# Altium project ZYNQ-HS-DEV.PrjPcb (part 2 of 4)

## Sheet ZHSD-USB-OTG.SchDoc
size A3; DocumentNumber: 10; SheetNumber: 10; SheetTotal: 17; Size: A3
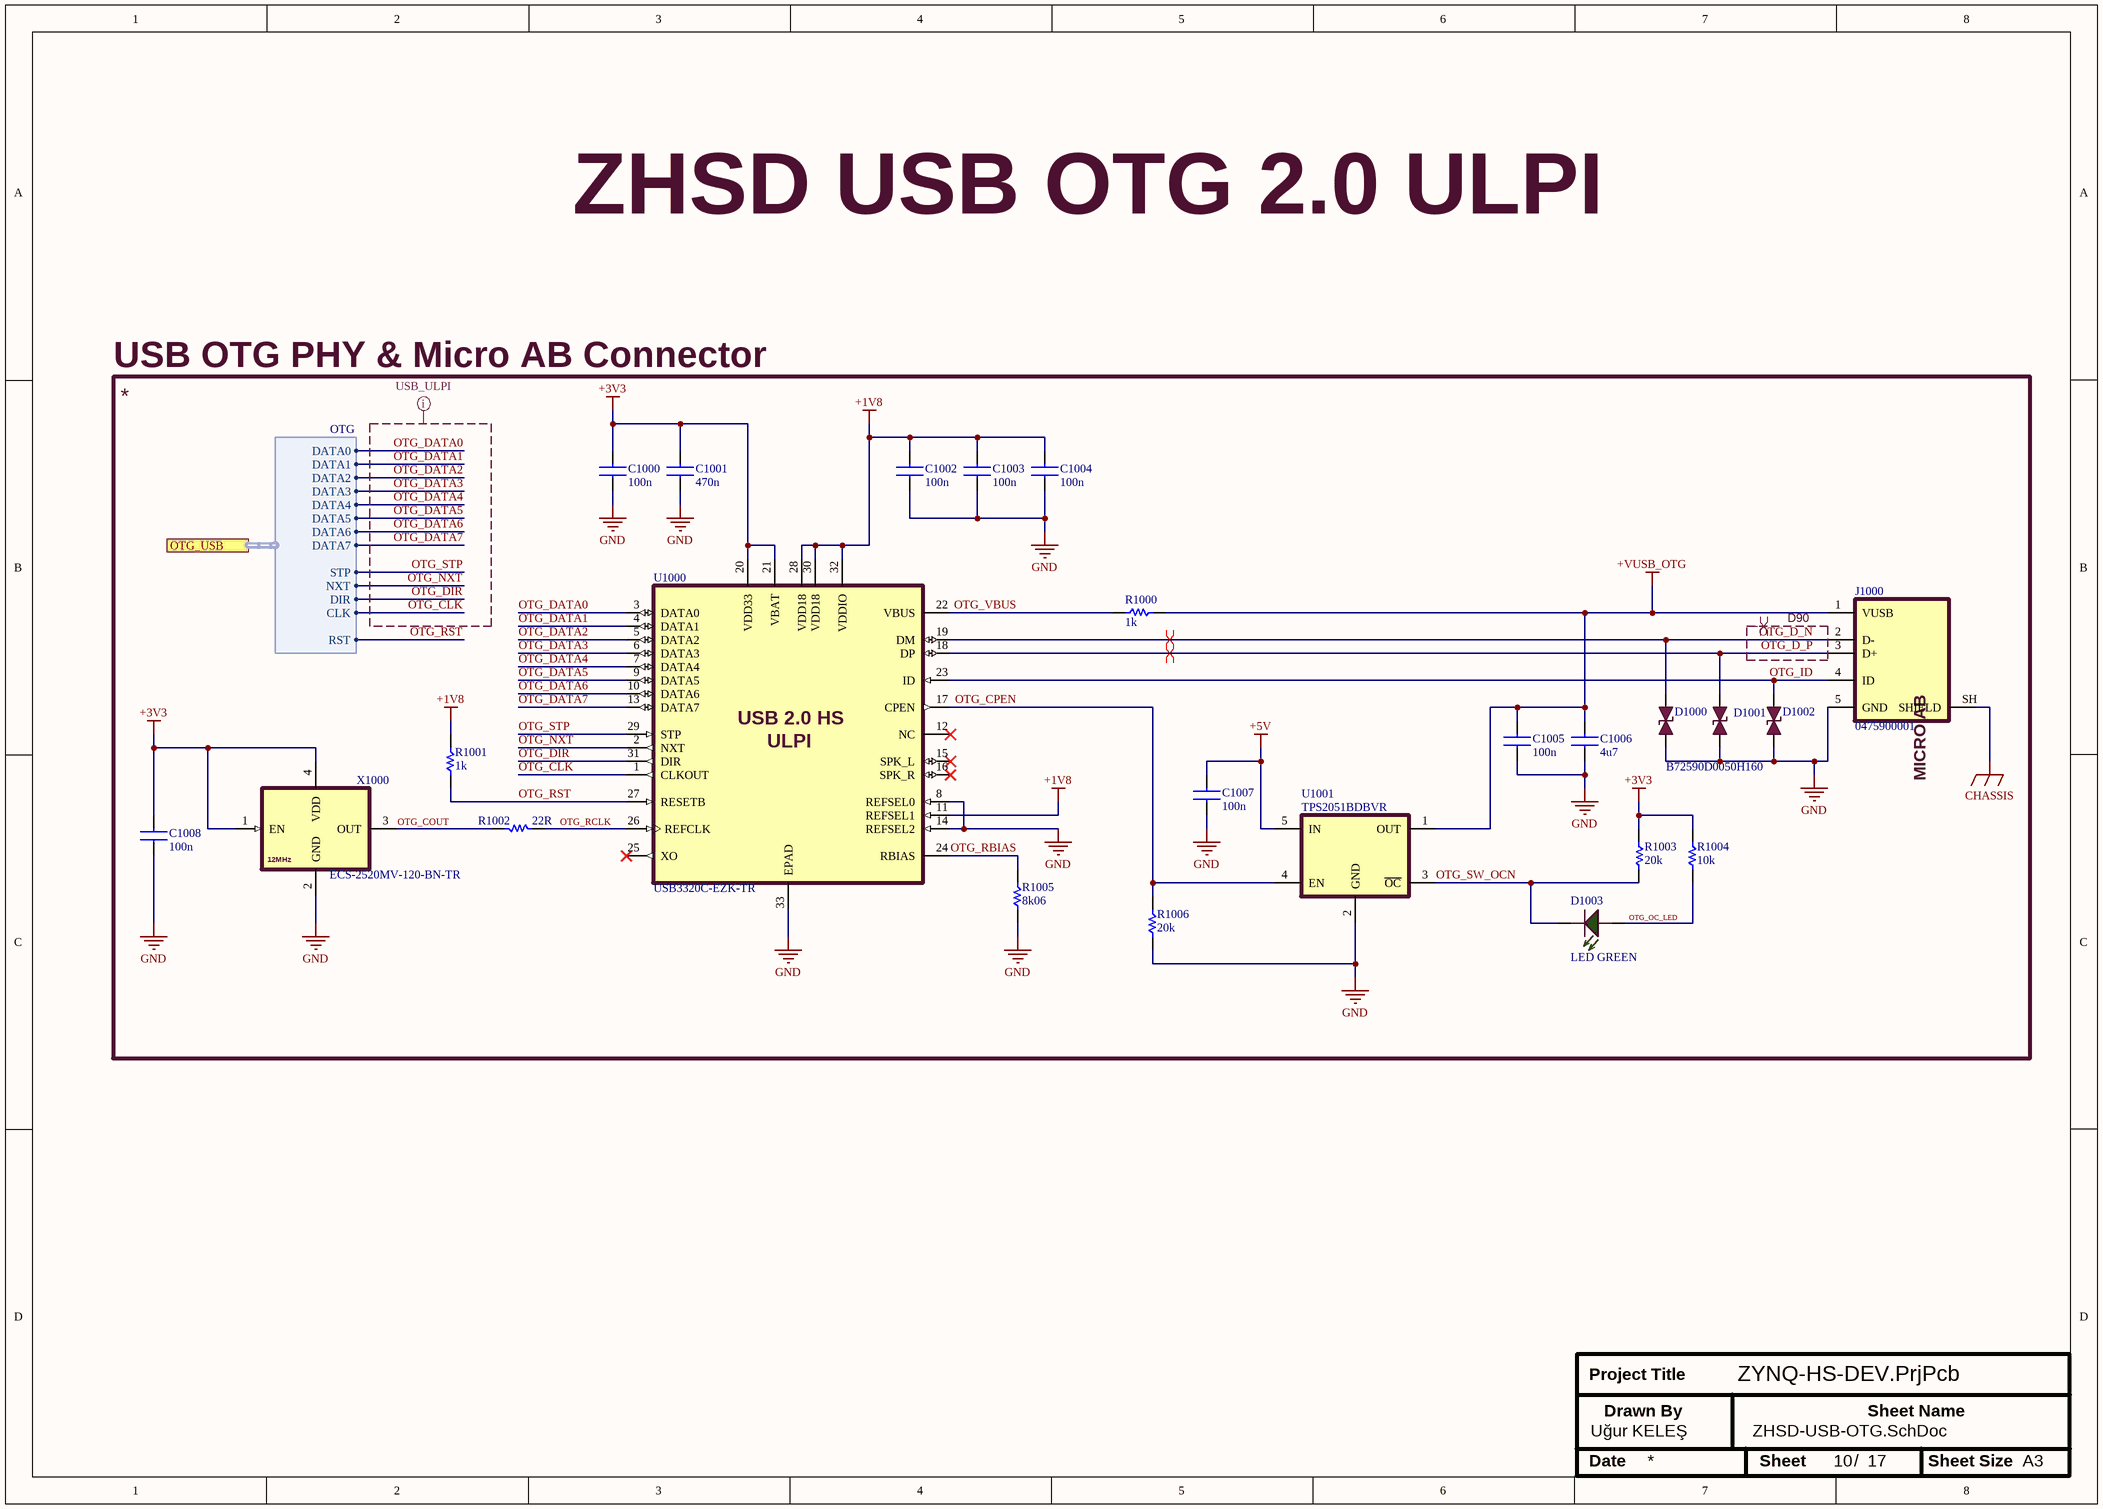
[diagram p6: ZHSD-USB-OTG.SchDoc]

### Parts
C1000  100n  [0603CAPC1608X09N]
C1001  470n  [0402CAPC1005X06N]
C1002  100n  [0603CAPC1608X09N]
C1003  100n  [0603CAPC1608X09N]
C1004  100n  [0603CAPC1608X09N]
C1005  100n  [0603CAPC1608X09N]
C1006  4u7  [0603CAPC1608X09N]
C1007  100n  [0603CAPC1608X09N]
C1008  100n  [0603CAPC1608X09N]
D1000  B72590D0050H160  [0402DIOC1005X06N]  (value not drawn)
D1001  B72590D0050H160  [0402DIOC1005X06N]  (value not drawn)
D1002  B72590D0050H160  [0402DIOC1005X06N]
D1003  LED GREEN  [0603_LED_1608N]
J1000  0475900001  [USB2.0 MICRO AB SMD]
R1000  1k  [0603RESC1608X05N]
R1001  1k  [0603RESC1608X05N]
R1002  22R  [0603RESC1608X05N]
R1003  20k  [0402RESC1005X04N]
R1004  10k  [0603RESC1608X05N]
R1005  8k06  [0402RESC1005X04N]
R1006  20k  [0402RESC1005X04N]
U1000  USB3320C-EZK-TR  [QFN50P500X500X100_HS-33N]
U1001  TPS2051BDBVR  [SOT95P280X125-5N]
X1000  ECS-2520MV-120-BN-TR  [XTAL_2520]

### Ports
OTG_USB (harness OTG, see ZHSD-Block[4000,3700], ZHSD-ZYNQ-MIO[8100,8300])

### Harnesses
OTG: DATA0, DATA1, DATA2, DATA3, DATA4, DATA5, DATA6, DATA7, STP, NXT, DIR, CLK, RST

### Nets
+1V8: C1002.2 C1003.2 C1004.2 R1001.2 U1000.11(REFSEL1) U1000.28(VDD18) U1000.30(VDD18) U1000.32(VDDIO)
+3V3: C1000.2 C1001.2 C1008.2 R1003.1 R1004.2 U1000.20(VDD33) U1000.21(VBAT) X1000.1(EN) X1000.4(VDD)
+5V: C1007.2 U1001.5(IN)
+VUSB_OTG: C1005.2 C1006.2 J1000.1(VUSB) R1000.2 U1001.1(OUT)
CHASSIS: J1000.SH(SHIELD)
GND: C1000.1 C1001.1 C1002.1 C1003.1 C1004.1 C1005.1 C1006.1 C1007.1 C1008.1 D1000.1 D1001.1 D1002.1 J1000.5(GND) R1005.1 R1006.1 U1000.8(REFSEL0) U1000.14(REFSEL2) U1000.33(EPAD) U1001.2(GND) X1000.2(GND)
OTG_CLK: U1000.1(CLKOUT) ; port OTG_USB.CLK
OTG_COUT: R1002.2 X1000.3(OUT)
OTG_CPEN: R1006.2 U1000.17(CPEN) U1001.4(EN)
OTG_D_N: D1000.2 J1000.2(D-) U1000.19(DM)
OTG_D_P: D1001.2 J1000.3(D+) U1000.18(DP)
OTG_DATA0: U1000.3(DATA0) ; port OTG_USB.DATA0
OTG_DATA1: U1000.4(DATA1) ; port OTG_USB.DATA1
OTG_DATA2: U1000.5(DATA2) ; port OTG_USB.DATA2
OTG_DATA3: U1000.6(DATA3) ; port OTG_USB.DATA3
OTG_DATA4: U1000.7(DATA4) ; port OTG_USB.DATA4
OTG_DATA5: U1000.9(DATA5) ; port OTG_USB.DATA5
OTG_DATA6: U1000.10(DATA6) ; port OTG_USB.DATA6
OTG_DATA7: U1000.13(DATA7) ; port OTG_USB.DATA7
OTG_DIR: U1000.31(DIR) ; port OTG_USB.DIR
OTG_ID: D1002.2 J1000.4(ID) U1000.23(ID)
OTG_NXT: U1000.2(NXT) ; port OTG_USB.NXT
OTG_OC_LED: D1003.1(A) R1004.1
OTG_RBIAS: R1005.2 U1000.24(RBIAS)
OTG_RCLK: R1002.1 U1000.26(REFCLK)
OTG_RST: R1001.1 U1000.27(RESETB) ; port OTG_USB.RST
OTG_STP: U1000.29(STP) ; port OTG_USB.STP
OTG_SW_OCN: D1003.2(C) R1003.2 U1001.3(~{OC})
OTG_VBUS: R1000.1 U1000.22(VBUS)

Not connected (* = marked no-connect by the designer): U1000 12(NC)* 15(SPK_L)* 16(SPK_R)* 25(XO)*

### Layout directives
differential pair: OTG_D_N, OTG_D_P
differential pair; differential pair class USB; rule Differential Pairs Routing [Pref Gap = 6.299mil    Min Gap  = 5mil    Max Gap  = 7.874milPref Width = 3.937mil    Min Width  = 3.937mil    Max Width  = 4.768mil]; Impedance: D90: OTG_D_N, OTG_D_P
net class USB_ULPI; rule Matched Net Lengths [Delay Tolerance = 10ps]: OTG_CLK, OTG_DATA0, OTG_DATA1, OTG_DATA2, OTG_DATA3, OTG_DATA4, OTG_DATA5, OTG_DATA6, OTG_DATA7, OTG_DIR, OTG_NXT, OTG_STP

### Notes on the sheet
- ZHSD USB OTG 2.0 ULPI
- USB OTG PHY & Micro AB Connector
- *
- Project Title
- Uğur KELEŞ
- Drawn By
- Sheet Name
- Date
- Sheet
- /
- Sheet Size
- A3
- (in symbol ECS-2520MV-120-BN-TR) 12MHz
- (in symbol USB3320C-EZK-TR) USB 2.0 HS; ULPI
- (in symbol USB-MICRO-AB) MICRO AB

### Library data of the parts
C1000 C1002-C1005 C1007 = GRM155R71C104KA88J: CAP CER 0.1UF 16V X7R 0402 (1005) ±10%; Manufacturer: Murata Electronics; Value: 0.1 µF; ComponentLink1Description: Datasheet; ComponentLink1URL: https://search.murata.co.jp/Ceramy/image/img/A01X/G101/ENG/GRM155R71C104KA88-01.pdf; MPN: GRM155R71C104KA88J; Package: 0402; Tolerance: ±10%; Voltage: 16V
C1001 = GRM155R60J474KE19D: CAP CER 0.47UF 6.3V X5R 0402(1005) ±10%; Manufacturer: Murata Electronics; Value: 0.47 µF; ComponentLink1Description: Datasheet; ComponentLink1URL: https://search.murata.co.jp/Ceramy/image/img/A01X/G101/ENG/GRM21BR71A475KE51-01.pdf; MPN: GRM155R60J474KE19D; Package: 0402; Tolerance: ±10%; Voltage: 6.3V
C1006 = CL10A475KP8NNNC: CAP CER 4.7UF 10V X5R 0603 (1608) ±10%; Manufacturer: Samsung Electro-Mechanics; Value: 4.7 µF; ComponentLink1Description: Datasheet; ComponentLink1URL: https://mm.digikey.com/Volume0/opasdata/d220001/medias/docus/609/CL10A475KP8NNNC_Spec.pdf; MPN: CL10A475KP8NNNC; Package: 0603; Tolerance: ±10%; Voltage: 10V
C1008 = C0603C104K5RACTU: CAP CER 0.1UF 50V X7R 0603 (1608) ±10%; Manufacturer: KEMET; Value: 0.1 µF; ComponentLink1Description: Datasheet; ComponentLink1URL: https://yageogroup.com/content/datasheet/asset/file/KEM_C1002_X7R_SMD; MPN: C0603C104K5RACTU; Package: 0603; Tolerance: ±10%; Voltage: 50V
D1000-D1002 = B72590D0050H160: Varistor 1 Circuit Surface Mount, MLCV 0402 (1005 Metric); Manufacturer: EPCOS - TDK Electronics; ComponentLink1Description: Datasheet; ComponentLink1URL: https://www.tdk-electronics.tdk.com/inf/75/ds/High_speed_series.pdf?ref_disty=digikey; MPN: B72590D0050H160; Package: 0402
D1003 = LTST-C191TGKT: as D400 on sheet ZHSD-ZYNQ-CONFIG; ComponentLink1Description: Datasheet; ComponentLink1URL: https://optoelectronics.liteon.com/upload/download/DS22-2000-300/LTST-C191TGKT.PDF; MPN: LTST-C191TGKT; Package: 0603
J1000 = USB-MICRO-AB: CONN RCPT MICRO USB AB 5P SMD RA; Manufacturer: Molex; ComponentLink1Description: Datasheet; ComponentLink1URL: https://www.molex.com/content/dam/molex/molex-dot-com/products/automated/en-us/salesdrawingpdf/475/47590/475900001_sd.pdf?inline; MPN: 0475900001
R1000 R1001 = RC0603FR-071KL: RES 1K OHM 1% 1/10W 0603 (1608); Manufacturer: YAGEO; Value: 1 kOhms; Voltage: 75V; ComponentLink1Description: Datasheet; ComponentLink1URL: https://yageogroup.com/content/datasheet/asset/file/PYU-RC_GROUP_51_ROHS_L; MPN: RC0603FR-071KL; Tolerance: ±1%; Package: 0603
R1002 = RC0603FR-0722RL: RES 22 OHM 1% 1/10W 0603 (1608); Manufacturer: YAGEO; Value: 22 Ohms; Voltage: 75V; ComponentLink1Description: Datasheet; ComponentLink1URL: https://yageogroup.com/content/datasheet/asset/file/PYU-RC_GROUP_51_ROHS_L; MPN: RC0603FR-0722RL; Tolerance: ±1%; Package: 0603
R1003 R1006 = RC0402FR-0720KL: RES 20K OHM 1% 1/16W 0402 (1005); Manufacturer: YAGEO; Value: 20 kOhms; Voltage: 50V; ComponentLink1Description: Datasheet; ComponentLink1URL: https://yageogroup.com/content/datasheet/asset/file/PYU-RT_1-TO-0-01_ROHS_L; MPN: RC0402FR-0720KL; Tolerance: ±1%; Package: 0402
R1004 = RC0603FR-0710KL: as R400 on sheet ZHSD-ZYNQ-CONFIG; ComponentLink1Description: Datasheet; ComponentLink1URL: https://yageogroup.com/content/datasheet/asset/file/PYU-RC_GROUP_51_ROHS_L; MPN: RC0603FR-0710KL; Tolerance: ±1%; Package: 0603
R1005 = RC0402FR-138K06L: RES 8.06K OHM 1% 1/16W 0402 (1005); Manufacturer: YAGEO; Value: 8.06 kOhms; Voltage: 50V; ComponentLink1Description: Datasheet; ComponentLink1URL: https://yageogroup.com/content/datasheet/asset/file/PYU-RT_1-TO-0-01_ROHS_L; MPN: RC0402FR-138K06L; Tolerance: ±1%; Package: 0402
U1000 = USB3320C-EZK-TR: Hi-Speed USB 2.0 ULPI Transceiver; Manufacturer: Microchip; MPN: USB3320C-EZK-TR; ComponentLink1Description: Datasheet; ComponentLink1URL: https://ww1.microchip.com/downloads/aemDocuments/documents/UNG/ProductDocuments/DataSheets/USB3320-Data-Sheet-DS00001792.pdf
U1001 = TPS2051BDBVR: Power Switch/Driver 1:1 N-Channel 500mA SOT-23-5; Manufacturer: Texas Instruments; ComponentLink1Description: Datasheet; ComponentLink1URL: https://www.ti.com/lit/ds/symlink/tps2051b.pdf?ts=1769451796682&ref_url=https%253A%252F%252Fwww.ti.com%252Fproduct%252FTPS2051B; MPN: TPS2051BDBVR
X1000 = ECS-2520MV-120-BN-TR: XTAL OSC XO 12.0000MHZ CMOS SMD; Manufacturer: ECS Inc.; ComponentLink1Description: Datasheet; ComponentLink1URL: https://ecsxtal.com/store/pdf/ECS-2520MV.pdf; MPN: ECS-2520MV-120-BN-TR

## Sheet ZHSD-ETHERNET.SchDoc
size A3; DrawnBy: UGUR KELES; DocumentNumber: 11; SheetNumber: 11; SheetTotal: 17; Size: A3
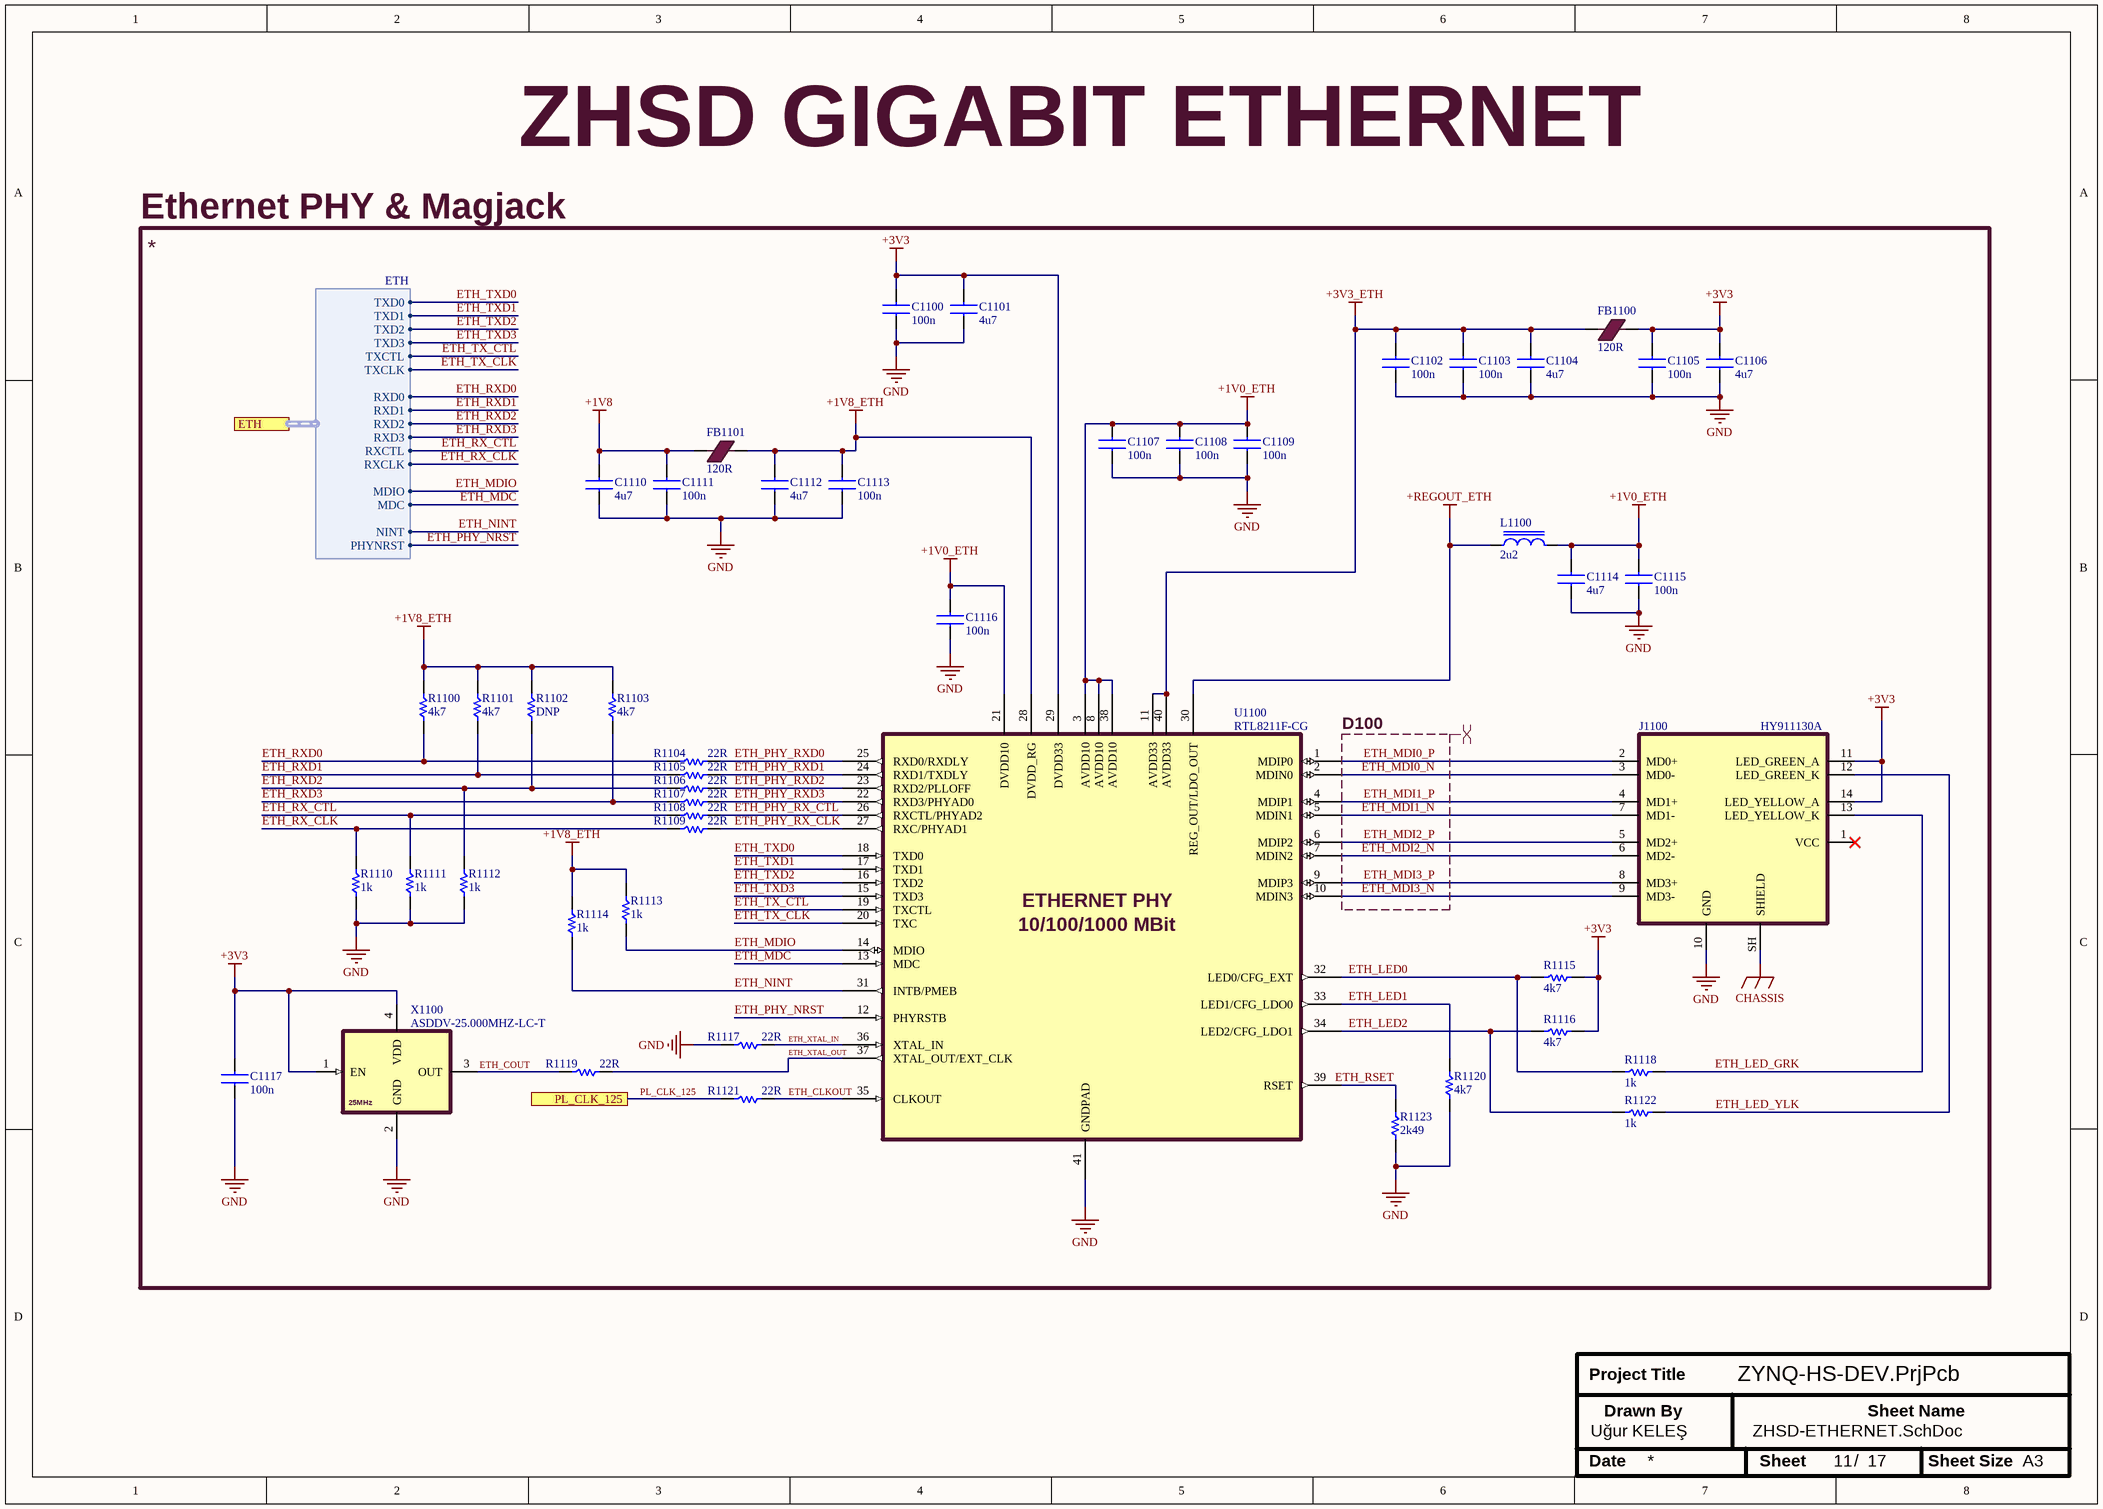
[diagram p7: ZHSD-ETHERNET.SchDoc]

### Parts
C1100  100n  [0603CAPC1608X09N]
C1101  4u7  [0603CAPC1608X09N]
C1102  100n  [0603CAPC1608X09N]
C1103  100n  [0603CAPC1608X09N]
C1104  4u7  [0603CAPC1608X09N]
C1105  100n  [0603CAPC1608X09N]
C1106  4u7  [0603CAPC1608X09N]
C1107  100n  [0603CAPC1608X09N]
C1108  100n  [0603CAPC1608X09N]
C1109  100n  [0603CAPC1608X09N]
C1110  4u7  [0603CAPC1608X09N]
C1111  100n  [0603CAPC1608X09N]
C1112  4u7  [0603CAPC1608X09N]
C1113  100n  [0603CAPC1608X09N]
C1114  4u7  [0603CAPC1608X09N]
C1115  100n  [0603CAPC1608X09N]
C1116  100n  [0603CAPC1608X09N]
C1117  100n  [0603CAPC1608X09N]
FB1100  120R  [0603INDC1608X08N]
FB1101  120R  [0603INDC1608X08N]
J1100  HY911130A  [HY911130A]
L1100  2u2  [0603INDC1608X08N]
R1100  4k7  [0402RESC1005X04N]
R1101  4k7  [0402RESC1005X04N]
R1102  DNP  [0402RESC1005X04N]
R1103  4k7  [0402RESC1005X04N]
R1104  22R  [0603RESC1608X05N]
R1105  22R  [0603RESC1608X05N]
R1106  22R  [0603RESC1608X05N]
R1107  22R  [0603RESC1608X05N]
R1108  22R  [0603RESC1608X05N]
R1109  22R  [0603RESC1608X05N]
R1110  1k  [0402RESC1005X04N]
R1111  1k  [0402RESC1005X04N]
R1112  1k  [0402RESC1005X04N]
R1113  1k  [0402RESC1005X04N]
R1114  1k  [0402RESC1005X04N]
R1115  4k7  [0402RESC1005X04N]
R1116  4k7  [0402RESC1005X04N]
R1117  22R  [0603RESC1608X05N]
R1118  1k  [0402RESC1005X04N]
R1119  22R  [0603RESC1608X05N]
R1120  4k7  [0402RESC1005X04N]
R1121  22R  [0603RESC1608X05N]
R1122  1k  [0402RESC1005X04N]
R1123  2k49  [0402RESC1005X04N]
U1100  RTL8211F-CG  [QFN40P500X500X90_HS-41N]
X1100  ASDDV-25.000MHZ-LC-T  [XTAL_2520]

### Ports
ETH (harness ETH, see ZHSD-Block[4000,2500], ZHSD-ZYNQ-MIO[14200,5300]), PL_CLK_125 (see ZHSD-Block[4000,2300], ZHSD-ZYNQ-PL[13800,7000])

### Harnesses
ETH: TXCLK, TXD0, TXD1, TXD2, TXD3, TXCTL, RXCLK, RXD0, RXD1, RXD2, RXD3, RXCTL, MDIO, MDC, NINT, PHYNRST

### Nets
+1V0_ETH: C1107.2 C1108.2 C1109.2 C1114.2 C1115.2 C1116.2 L1100.2 U1100.3(AVDD10) U1100.8(AVDD10) U1100.21(DVDD10) U1100.38(AVDD10)
+1V8: C1110.2 C1111.2 FB1101.1
+1V8_ETH: C1112.2 C1113.2 FB1101.2 R1100.2 R1101.2 R1102.2 R1103.2 R1113.2 R1114.2 U1100.28(DVDD_RG)
+3V3: C1100.2 C1101.2 C1105.2 C1106.2 C1117.2 FB1100.2 J1100.11(LED_GREEN_A) J1100.14(LED_YELLOW_A) R1115.1 R1116.1 U1100.29(DVDD33) X1100.1(EN) X1100.4(VDD)
+3V3_ETH: C1102.2 C1103.2 C1104.2 FB1100.1 U1100.11(AVDD33) U1100.40(AVDD33)
+REGOUT_ETH: L1100.1 U1100.30(REG_OUT/LDO_OUT)
CHASSIS: J1100.SH(SHIELD)
GND: C1100.1 C1101.1 C1102.1 C1103.1 C1104.1 C1105.1 C1106.1 C1107.1 C1108.1 C1109.1 C1110.1 C1111.1 C1112.1 C1113.1 C1114.1 C1115.1 C1116.1 C1117.1 J1100.10(GND) R1110.1 R1111.1 R1112.1 R1117.2 R1120.1 R1123.1 U1100.41(GNDPAD) X1100.2(GND)
ETH_CLKOUT: R1121.1 U1100.35(CLKOUT)
ETH_COUT: R1119.2 X1100.3(OUT)
ETH_LED0: R1115.2 R1118.2 U1100.32(LED0/CFG_EXT)
ETH_LED1: R1120.2 U1100.33(LED1/CFG_LDO0)
ETH_LED2: R1116.2 R1122.2 U1100.34(LED2/CFG_LDO1)
ETH_LED_GRK: J1100.13(LED_YELLOW_K) R1118.1
ETH_LED_YLK: J1100.12(LED_GREEN_K) R1122.1
ETH_MDC: U1100.13(MDC) ; port ETH.MDC
ETH_MDI0_N: J1100.3(MD0-) U1100.2(MDIN0)
ETH_MDI0_P: J1100.2(MD0+) U1100.1(MDIP0)
ETH_MDI1_N: J1100.7(MD1-) U1100.5(MDIN1)
ETH_MDI1_P: J1100.4(MD1+) U1100.4(MDIP1)
ETH_MDI2_N: J1100.6(MD2-) U1100.7(MDIN2)
ETH_MDI2_P: J1100.5(MD2+) U1100.6(MDIP2)
ETH_MDI3_N: J1100.9(MD3-) U1100.10(MDIN3)
ETH_MDI3_P: J1100.8(MD3+) U1100.9(MDIP3)
ETH_MDIO: R1113.1 U1100.14(MDIO) ; port ETH.MDIO
ETH_NINT: R1114.1 U1100.31(INTB/PMEB) ; port ETH.NINT
ETH_PHY_NRST: U1100.12(PHYRSTB) ; port ETH.PHYNRST
ETH_PHY_RX_CLK: R1109.1 U1100.27(RXC/PHYAD1)
ETH_PHY_RX_CTL: R1108.1 U1100.26(RXCTL/PHYAD2)
ETH_PHY_RXD0: R1104.1 U1100.25(RXD0/RXDLY)
ETH_PHY_RXD1: R1105.1 U1100.24(RXD1/TXDLY)
ETH_PHY_RXD2: R1106.1 U1100.23(RXD2/PLLOFF)
ETH_PHY_RXD3: R1107.1 U1100.22(RXD3/PHYAD0)
ETH_RSET: R1123.2 U1100.39(RSET)
ETH_RX_CLK: R1109.2 R1110.2 ; port ETH.RXCLK
ETH_RX_CTL: R1108.2 R1111.2 ; port ETH.RXCTL
ETH_RXD0: R1100.1 R1104.2 ; port ETH.RXD0
ETH_RXD1: R1101.1 R1105.2 ; port ETH.RXD1
ETH_RXD2: R1102.1 R1106.2 R1112.2 ; port ETH.RXD2
ETH_RXD3: R1103.1 R1107.2 ; port ETH.RXD3
ETH_TX_CLK: U1100.20(TXC) ; port ETH.TXCLK
ETH_TX_CTL: U1100.19(TXCTL) ; port ETH.TXCTL
ETH_TXD0: U1100.18(TXD0) ; port ETH.TXD0
ETH_TXD1: U1100.17(TXD1) ; port ETH.TXD1
ETH_TXD2: U1100.16(TXD2) ; port ETH.TXD2
ETH_TXD3: U1100.15(TXD3) ; port ETH.TXD3
ETH_XTAL_IN: R1117.1 U1100.36(XTAL_IN)
ETH_XTAL_OUT: R1119.1 U1100.37(XTAL_OUT/EXT_CLK)
PL_CLK_125: R1121.2 ; port PL_CLK_125

Not connected (* = marked no-connect by the designer): J1100 1(VCC)*

### Layout directives
differential pair; differential pair class GiE; rule Differential Pairs Routing [Pref Gap = 10mil    Min Gap  = 5mil    Max Gap  = 10milPref Width = 3.937mil    Min Width  = 3.543mil    Max Width  = 3.937mil]: ETH_MDI0_N, ETH_MDI0_P, ETH_MDI1_N, ETH_MDI1_P, ETH_MDI2_N, ETH_MDI2_P, ETH_MDI3_N, ETH_MDI3_P

### Notes on the sheet
- ZHSD GIGABIT ETHERNET
- Ethernet PHY & Magjack
- *
- (near U1100) D100
- Project Title
- Uğur KELEŞ
- Drawn By
- Sheet Name
- Date
- Sheet
- /
- Sheet Size
- A3
- (in symbol ASDDV-25.000MHZ-LC-T) 25MHz
- (in symbol RTL8211F-CG) ETHERNET PHY; 10/100/1000 MBit

### Library data of the parts
C1100 C1102 C1103 C1105 C1107-C1109 C1111 C1113 C1115 C1116 = GRM155R71C104KA88J: as C1000 on sheet ZHSD-USB-OTG; ComponentLink1Description: Datasheet; ComponentLink1URL: https://search.murata.co.jp/Ceramy/image/img/A01X/G101/ENG/GRM155R71C104KA88-01.pdf; MPN: GRM155R71C104KA88J; Package: 0402; Tolerance: ±10%; Voltage: 16V
C1101 C1104 C1106 C1110 C1112 C1114 = CL10A475KP8NNNC: as C1006 on sheet ZHSD-USB-OTG; ComponentLink1Description: Datasheet; ComponentLink1URL: https://mm.digikey.com/Volume0/opasdata/d220001/medias/docus/609/CL10A475KP8NNNC_Spec.pdf; MPN: CL10A475KP8NNNC; Package: 0603; Tolerance: ±10%; Voltage: 10V
C1117 = C0603C104K5RACTU: as C1008 on sheet ZHSD-USB-OTG; ComponentLink1Description: Datasheet; ComponentLink1URL: https://yageogroup.com/content/datasheet/asset/file/KEM_C1002_X7R_SMD; MPN: C0603C104K5RACTU; Package: 0603; Tolerance: ±10%; Voltage: 50V
FB1100 FB1101 = BLM18SG121TN1D: FERRITE BEAD 120 OHM 0603 (1608) 3A 25mOhm; Manufacturer: Murata Electronics; Impedance @ Frequency: 120 Ohms @ 100 MHz; ComponentLink1Description: Datasheet; ComponentLink1URL: https://pim.murata.com/asset/pim4/ferriteBeadInductortypefilter/ENFA0003_PDF_FERRITEBEADINDUCTORTYPEFILTER?lastModifiedDatetime=20250707190934; ComponentLink2Description: Website; ComponentLink2URL: https://pim.murata.com/en-global/pim/details/?partNum=BLM18SG121TN1%23; Current Rating (Max): 3A; DC Resistance (DCR) (Max): 25mOhm; MPN: BLM18SG121TN1D; Package: 0603
J1100 = HY911130A: Jack Modular Connector RJ45 Through Hole Shielded; Manufacturer: Hanrun; MPN: HY911130A; ComponentLink1Description: Datasheet; ComponentLink1URL: https://www.lcsc.com/datasheet/C55679.pdf
L1100 = LQM18PN2R2MGHD: FIXED IND 2.2UH 1.05A 250 MOHM 0603 (1608 Metric); Manufacturer: Murata Electronics; Inductance: 2.2 µH; Current - Saturation (Isat): 250mA; ComponentLink1Description: Datasheet; ComponentLink1URL: https://search.murata.co.jp/Ceramy/image/img/P02/JELF243B-0047.pdf; ComponentLink2Description: Website; ComponentLink2URL: https://pim.murata.com/en-eu/pim/details/?partNum=LQM18PN2R2MGHD; Current Rating (Max): 1.05 A; DC Resistance (DCR) (Max): 250mOhm; MPN: LQM18PN2R2MGHD; Package: 0603
R1100 R1101 R1103 R1115 R1116 R1120 = RC0402JR-074K7L: RES 4.7K OHM 5% 1/16W 0402 (1005); Manufacturer: YAGEO; MPN: RT0402FRE0780RL; Value: 4.7 kOhms; Voltage: 50V; ComponentLink1Description: Datasheet; ComponentLink1URL: https://yageogroup.com/content/datasheet/asset/file/PYU-RC_GROUP_51_ROHS_L; Tolerance: ±5%; Package: 0402
R1102 = DNP_RES: DO NOT POPULATE RESISTOR; Manufacturer: ***; Value: ***; ComponentLink1Description: Datasheet; ComponentLink1URL: https://yageogroup.com/content/datasheet/asset/file/PYU-RT_1-TO-0-01_ROHS_L; MPN: ***; Voltage: ***; Tolerance: ***; Package: 0402
R1104-R1109 R1117 R1119 R1121 = RC0603FR-0722RL: as R1002 on sheet ZHSD-USB-OTG; ComponentLink1Description: Datasheet; ComponentLink1URL: https://yageogroup.com/content/datasheet/asset/file/PYU-RC_GROUP_51_ROHS_L; MPN: RC0603FR-0722RL; Tolerance: ±1%; Package: 0603
R1110-R1114 R1118 R1122 = RC0402JR-071KL: as R404 on sheet ZHSD-ZYNQ-CONFIG; ComponentLink1Description: Datasheet; ComponentLink1URL: https://yageogroup.com/content/datasheet/asset/file/PYU-RT_1-TO-0-01_ROHS_L; MPN: RC0402JR-071KL; Tolerance: ±5%; Package: 0402
R1123 = RC0402FR-132K49L: RES 2.49K OHM 1% 1/16W 0402 (1005); Manufacturer: YAGEO; Value: 2.49 kOhms; Voltage: 50V; ComponentLink1Description: Datasheet; ComponentLink1URL: https://yageogroup.com/content/datasheet/asset/file/PYU-RC_GROUP_51_ROHS_L; MPN: RC0402FR-132K49L; Tolerance: ±1%; Package: 0402
U1100 = RTL8211F-CG: RGMII Ethernet Transceiver WQFN-40-EP(5x5) Drivers, Receivers, Transceivers RoHS; Manufacturer: REALTEK; ComponentLink1Description: Datasheet; ComponentLink1URL: https://www.lcsc.com/datasheet/C187932.pdf; MPN: RTL8211F-CG
X1100 = ASDDV-25.000MHZ-LC-T: 25 MHz XO (Standard) HCMOS, LVCMOS Oscillator 1.6V ~ 3.6V Enable/Disable 4-SMD, No Lead; Manufacturer: Abracon LLC; ComponentLink1Description: Datasheet; ComponentLink1URL: https://abracon.com/datasheets/ASDDV.pdf; MPN: ASDDV-25.000MHZ-LC-T

## Sheet ZHSD-USB-UART.SchDoc
size A4; DrawnBy: UGUR KELES; DocumentNumber: 12; SheetNumber: 12; SheetTotal: 17; Size: A4
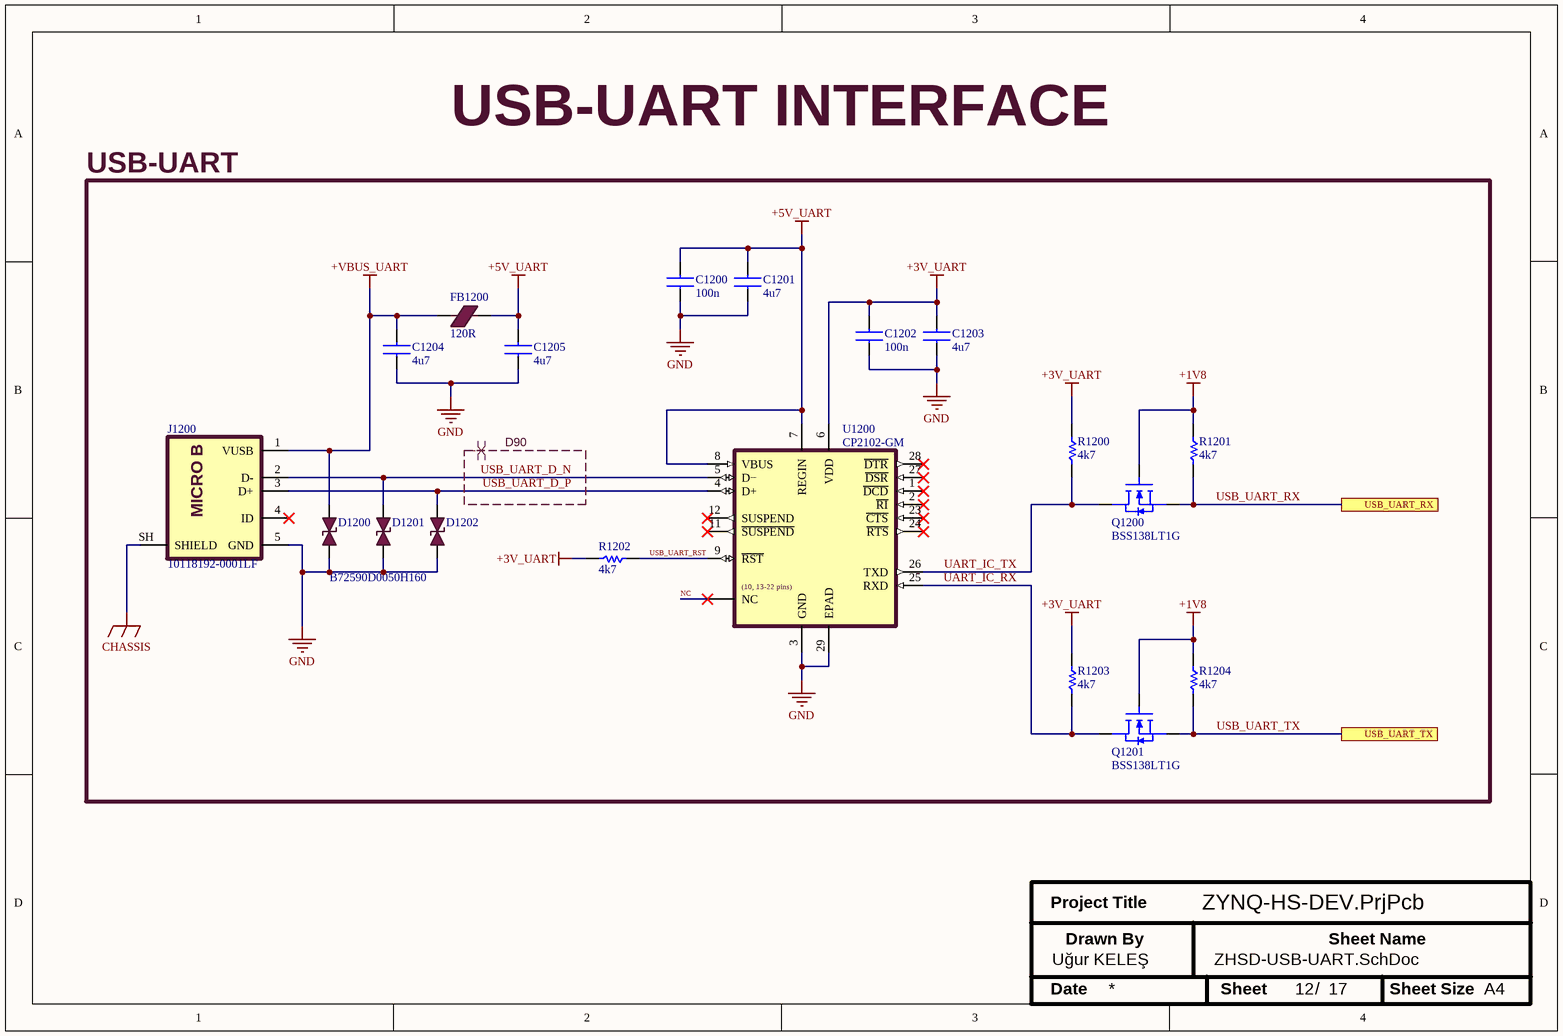
[diagram p8: ZHSD-USB-UART.SchDoc]

### Parts
C1200  100n  [0603CAPC1608X09N]
C1201  4u7  [0603CAPC1608X09N]
C1202  100n  [0603CAPC1608X09N]
C1203  4u7  [0603CAPC1608X09N]
C1204  4u7  [0603CAPC1608X09N]
C1205  4u7  [0603CAPC1608X09N]
D1200  B72590D0050H160  [0402DIOC1005X06N]
D1201  B72590D0050H160  [0402DIOC1005X06N]  (value not drawn)
D1202  B72590D0050H160  [0402DIOC1005X06N]  (value not drawn)
FB1200  120R  [0603INDC1608X08N]
J1200  10118192-0001LF  [USB2.0 MICRO B SMD]
Q1200  BSS138LT1G  [SOT95P237X89-3N]
Q1201  BSS138LT1G  [SOT95P237X89-3N]
R1200  4k7  [0402RESC1005X04N]
R1201  4k7  [0402RESC1005X04N]
R1202  4k7  [0402RESC1005X04N]
R1203  4k7  [0402RESC1005X04N]
R1204  4k7  [0402RESC1005X04N]
U1200  CP2102-GM  [QFN50P500X500X100_HS-29N]

### Blocks framed on the sheet
USB-UART: C1200-C1205 D1200-D1202 FB1200 J1200 Q1200 Q1201 R1200-R1204 U1200

### Ports
USB_UART_RX (see ZHSD-Block[4000,4300], ZHSD-ZYNQ-MIO[3600,1600]), USB_UART_TX (see ZHSD-Block[4000,4400], ZHSD-ZYNQ-MIO[3600,1700])

### Nets
+1V8: Q1200.1(G) Q1201.1(G) R1201.1 R1204.1
+3V_UART: C1202.2 C1203.2 R1200.1 R1202.2 R1203.1 U1200.6(VDD)
+5V_UART: C1200.2 C1201.2 C1205.2 FB1200.2 U1200.7(REGIN) U1200.8(VBUS)
+VBUS_UART: C1204.2 D1200.2 FB1200.1 J1200.1(VUSB)
CHASSIS: J1200.SH(SHIELD)
GND: C1200.1 C1201.1 C1202.1 C1203.1 C1204.1 C1205.1 D1200.1 D1201.1 D1202.1 J1200.5(GND) U1200.3(GND) U1200.29(EPAD)
NC: U1200.NC
UART_IC_RX: Q1201.3(D) R1203.2 U1200.25(RXD)
UART_IC_TX: Q1200.3(D) R1200.2 U1200.26(TXD)
USB_UART_D_N: D1201.2 J1200.2(D-) U1200.5(D−)
USB_UART_D_P: D1202.2 J1200.3(D+) U1200.4(D+)
USB_UART_RST: R1202.1 U1200.9(~{RST})
USB_UART_RX: Q1200.2(S) R1201.2 ; port USB_UART_RX
USB_UART_TX: Q1201.2(S) R1204.2 ; port USB_UART_TX

Not connected (* = marked no-connect by the designer): J1200 4(ID)*; U1200 1(~{DCD})* 2(~{RI})* 11(~{SUSPEND})* 12(SUSPEND)* 23(~{CTS})* 24(~{RTS})* 27(~{DSR})* 28(~{DTR})*

### Layout directives
differential pair; differential pair class USB; rule Differential Pairs Routing [Pref Gap = 6.299mil    Min Gap  = 5mil    Max Gap  = 7.874milPref Width = 3.937mil    Min Width  = 3.937mil    Max Width  = 4.768mil]; Impedance: D90: USB_UART_D_N, USB_UART_D_P

### Notes on the sheet
- USB-UART INTERFACE
- Project Title
- Uğur KELEŞ
- Drawn By
- Sheet Name
- Date
- Sheet
- /
- Sheet Size
- A4
- (in symbol CP2102-GM) (10, 13-22 pins)
- (in symbol USB-MICRO-B) MICRO B

### Library data of the parts
C1200 C1202 = GRM155R71C104KA88J: as C1000 on sheet ZHSD-USB-OTG; ComponentLink1Description: Datasheet; ComponentLink1URL: https://search.murata.co.jp/Ceramy/image/img/A01X/G101/ENG/GRM155R71C104KA88-01.pdf; MPN: GRM155R71C104KA88J; Package: 0402; Tolerance: ±10%; Voltage: 16V
C1201 C1203-C1205 = CL10A475KP8NNNC: as C1006 on sheet ZHSD-USB-OTG; ComponentLink1Description: Datasheet; ComponentLink1URL: https://mm.digikey.com/Volume0/opasdata/d220001/medias/docus/609/CL10A475KP8NNNC_Spec.pdf; MPN: CL10A475KP8NNNC; Package: 0603; Tolerance: ±10%; Voltage: 10V
D1200-D1202 = B72590D0050H160: as D1000 on sheet ZHSD-USB-OTG; ComponentLink1Description: Datasheet; ComponentLink1URL: https://www.tdk-electronics.tdk.com/inf/75/ds/High_speed_series.pdf?ref_disty=digikey; MPN: B72590D0050H160; Package: 0402
FB1200 = BLM18SG121TN1D: as FB1100 on sheet ZHSD-ETHERNET; ComponentLink1Description: Datasheet; ComponentLink1URL: https://pim.murata.com/asset/pim4/ferriteBeadInductortypefilter/ENFA0003_PDF_FERRITEBEADINDUCTORTYPEFILTER?lastModifiedDatetime=20250707190934; ComponentLink2Description: Website; ComponentLink2URL: https://pim.murata.com/en-global/pim/details/?partNum=BLM18SG121TN1%23; Current Rating (Max): 3A; DC Resistance (DCR) (Max): 25mOhm; MPN: BLM18SG121TN1D; Package: 0603
J1200 = USB-MICRO-B: CONN RCPT USB2.0 MICRO B SMD R/A; Manufacturer: Amphenol ICC (FCI); ComponentLink1Description: Datasheet; ComponentLink1URL: https://cdn.amphenol-cs.com/media/wysiwyg/files/documentation/datasheet/inputoutput/io_usb_micro.pdf; MPN: 10118192-0001LF
Q1200 Q1201 = BSS138LT1G: N-Channel 50 V 200mA (Ta) 225mW (Ta) Surface Mount SOT-23-3 (TO-236); Manufacturer: onsemi; Drain to Source Voltage (Vdss): 50 V; Rds On (Max) @ Id, Vgs: 3.5Ohm @ 200mA, 5V; Vgs (Max): ±20V; ComponentLink1Description: Datasheet; ComponentLink1URL: https://www.onsemi.com/pdf/datasheet/bss138lt1-d.pdf; MPN: BSS138LT1G; Package: SOT-23-3
R1200-R1204 = RC0402JR-074K7L: as R1100 on sheet ZHSD-ETHERNET; ComponentLink1Description: Datasheet; ComponentLink1URL: https://yageogroup.com/content/datasheet/asset/file/PYU-RC_GROUP_51_ROHS_L; Tolerance: ±5%; Package: 0402
U1200 = CP2102-GM: USB Bridge, USB to UART USB 2.0 UART Interface 28-QFN (5x5); pin to pad: NC>10+13+14+15+16+17+18+19+20+21+22; Manufacturer: Silicon Labs; ComponentLink1Description: Datasheet; ComponentLink1URL: https://www.silabs.com/documents/public/data-sheets/CP2102-9.pdf; MPN: CP2102-GM

## Sheet ZHSD-RS485-CAN.SchDoc
size A4; DocumentNumber: 13; SheetNumber: 13; SheetTotal: 17; Size: A4
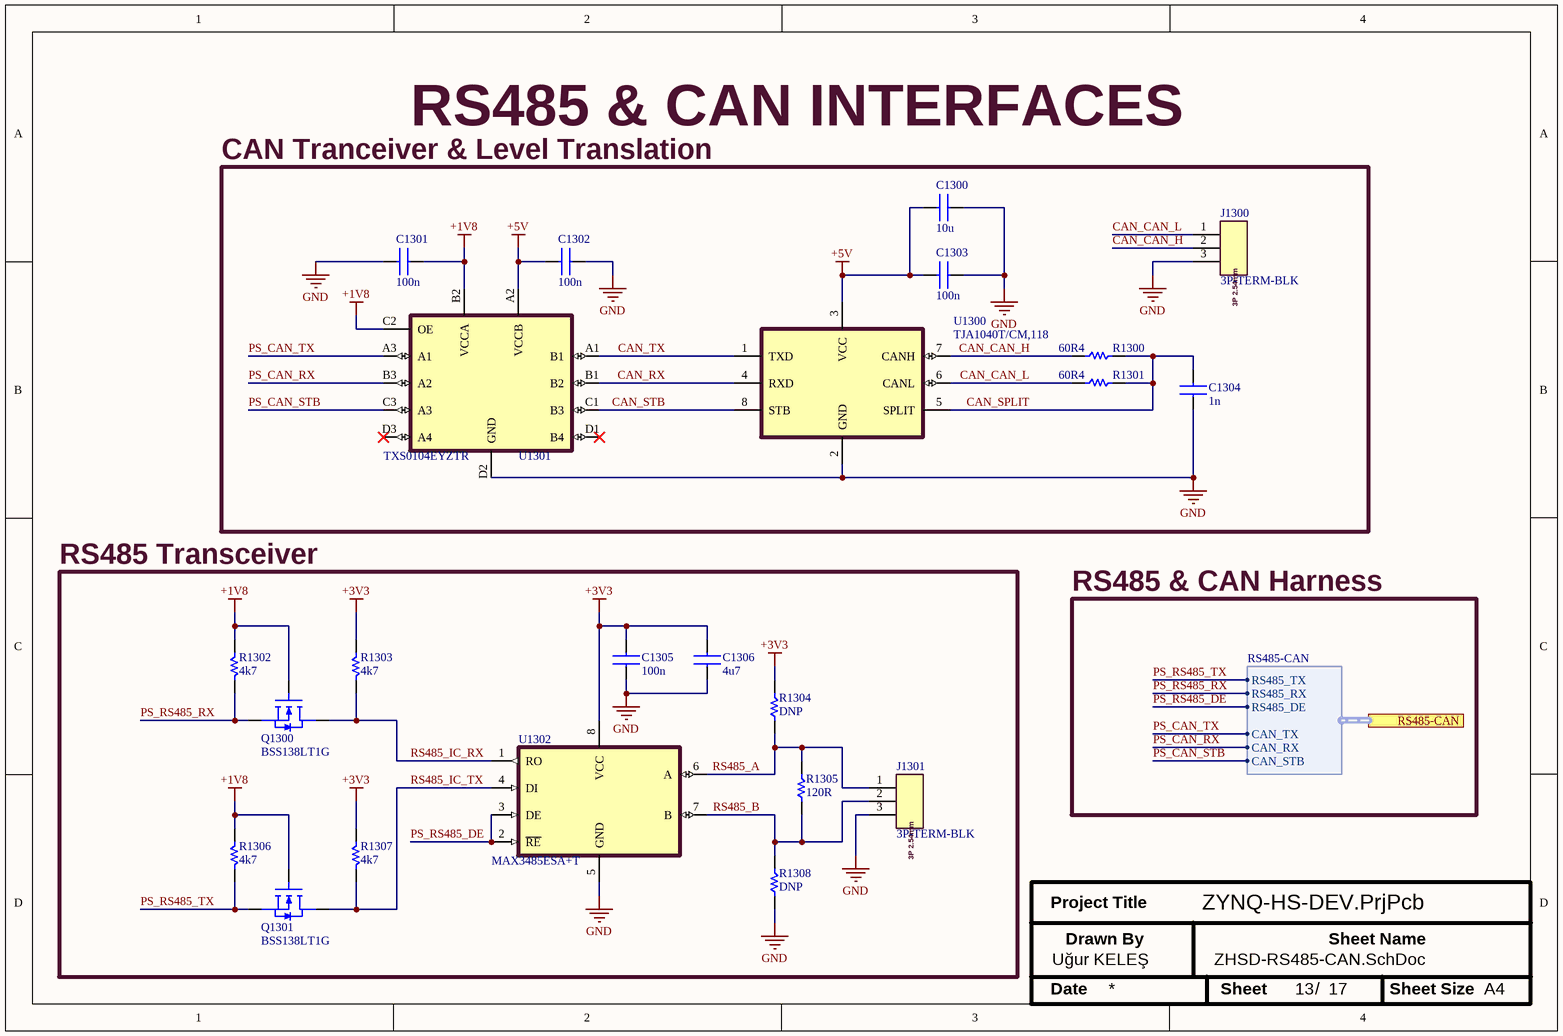
[diagram p9: ZHSD-RS485-CAN.SchDoc]

### Parts
C1300  10u  [0603CAPC1608X09N]
C1301  100n  [0603CAPC1608X09N]
C1302  100n  [0603CAPC1608X09N]
C1303  100n  [0603CAPC1608X09N]
C1304  1n  [0603CAPC1608X09N]
C1305  100n  [0603CAPC1608X09N]
C1306  4u7  [0603CAPC1608X09N]
J1300  3P-TERM-BLK  [CONN-3P-TERM-BLK]
J1301  3P-TERM-BLK  [CONN-3P-TERM-BLK]
Q1300  BSS138LT1G  [SOT95P237X89-3N]
Q1301  BSS138LT1G  [SOT95P237X89-3N]
R1300  60R4  [0402RESC1005X04N]
R1301  60R4  [0402RESC1005X04N]
R1302  4k7  [0402RESC1005X04N]
R1303  4k7  [0402RESC1005X04N]
R1304  DNP  [0402RESC1005X04N]
R1305  120R  [0402RESC1005X04N]
R1306  4k7  [0402RESC1005X04N]
R1307  4k7  [0402RESC1005X04N]
R1308  DNP  [0402RESC1005X04N]
U1300  TJA1040T/CM,118  [SOIC127P600X175-8N]
U1301  TXS0104EYZTR  [BGA12C50P3X4]
U1302  MAX3485ESA+T  [SOIC127P600X175-8N]

### Blocks framed on the sheet
CAN Tranceiver & Level Translation: C1300-C1304 J1300 R1300 R1301 U1300 U1301
RS485 Transceiver: C1305 C1306 J1301 Q1300 Q1301 R1302-R1308 U1302

### Ports
RS485-CAN (harness RS485-CAN, see ZHSD-Block[3600,3000], ZHSD-ZYNQ-MIO[10100,7700])

### Harnesses
RS485-CAN: RS485_TX, RS485_RX, RS485_DE, CAN_TX, CAN_RX, CAN_STB

### Nets
+1V8: C1301.2 Q1300.1(G) Q1301.1(G) R1302.1 R1306.1 U1301.B2(VCCA) U1301.C2(OE)
+3V3: C1305.2 C1306.2 R1303.1 R1304.2 R1307.1 U1302.8(VCC)
+5V: C1300.2 C1302.2 C1303.2 U1300.3(VCC) U1301.A2(VCCB)
GND: C1300.1 C1301.1 C1302.1 C1303.1 C1304.1 C1305.1 C1306.1 J1300.3 J1301.3 R1308.1 U1300.2(GND) U1301.D2(GND) U1302.5(GND)
CAN_CAN_H: J1300.2 R1300.1 U1300.7(CANH)
CAN_CAN_L: J1300.1 R1301.1 U1300.6(CANL)
CAN_RX: U1300.4(RXD) U1301.B1(B2)
CAN_SPLIT: C1304.2 R1300.2 R1301.2 U1300.5(SPLIT)
CAN_STB: U1300.8(STB) U1301.C1(B3)
CAN_TX: U1300.1(TXD) U1301.A1(B1)
PS_CAN_RX: U1301.B3(A2) ; port RS485-CAN.CAN_RX  [project net RSCAN.CAN_RX]
PS_CAN_STB: U1301.C3(A3) ; port RS485-CAN.CAN_STB  [project net RSCAN.CAN_STB]
PS_CAN_TX: U1301.A3(A1) ; port RS485-CAN.CAN_TX  [project net RSCAN.CAN_TX]
PS_RS485_DE: U1302.2(~{RE}) U1302.3(DE) ; port RS485-CAN.RS485_DE  [project net RSCAN.RS485_DE]
PS_RS485_RX: Q1300.2(S) R1302.2 ; port RS485-CAN.RS485_RX  [project net RSCAN.RS485_RX]
PS_RS485_TX: Q1301.2(S) R1306.2 ; port RS485-CAN.RS485_TX  [project net RSCAN.RS485_TX]
RS485_A: J1301.1 R1304.1 R1305.2 U1302.6(A)
RS485_B: J1301.2 R1305.1 R1308.2 U1302.7(B)
RS485_IC_RX: Q1300.3(D) R1303.2 U1302.1(RO)
RS485_IC_TX: Q1301.3(D) R1307.2 U1302.4(DI)

Not connected (* = marked no-connect by the designer): U1301 D1(B4)* D3(A4)*

### Notes on the sheet
- RS485 & CAN INTERFACES
- RS485 & CAN Harness
- Project Title
- Uğur KELEŞ
- Drawn By
- Sheet Name
- Date
- Sheet
- /
- Sheet Size
- A4
- (in symbol 282834-3) 3P 2.54mm

### Library data of the parts
C1300 = GRM188Z71A106MA73D: CAP CER 10UF 10V X7R 0603 (1608) ±20%; Manufacturer: Murata Electronics; Value: 10 µF; ComponentLink1Description: Datasheet; ComponentLink1URL: https://search.murata.co.jp/Ceramy/image/img/A01X/G101/ENG/GRM188Z71A106MA73-01A.pdf; MPN: GRM188Z71A106MA73D; Package: 0603; Tolerance: ±20%; Voltage: 10V
C1301-C1303 C1305 = GRM155R71C104KA88J: as C1000 on sheet ZHSD-USB-OTG; ComponentLink1Description: Datasheet; ComponentLink1URL: https://search.murata.co.jp/Ceramy/image/img/A01X/G101/ENG/GRM155R71C104KA88-01.pdf; MPN: GRM155R71C104KA88J; Package: 0402; Tolerance: ±10%; Voltage: 16V
C1304 = GCM188R71H102KA37D: CAP CER 1000PF 50V X7R 0603 (1608) ±10%; Manufacturer: Murata Electronics; ComponentLink1Description: Datasheet; ComponentLink1URL: https://search.murata.co.jp/Ceramy/image/img/A01X/G101/ENG/GCM188R71H102KA37-01.pdf; MPN: GCM188R71H102KA37D; Package: 0603; Tolerance: ±10%; Value: 1000 pF; Voltage: 50V
C1306 = CL10A475KP8NNNC: as C1006 on sheet ZHSD-USB-OTG; ComponentLink1Description: Datasheet; ComponentLink1URL: https://mm.digikey.com/Volume0/opasdata/d220001/medias/docus/609/CL10A475KP8NNNC_Spec.pdf; MPN: CL10A475KP8NNNC; Package: 0603; Tolerance: ±10%; Voltage: 10V
J1300 J1301 = 282834-3: TERM BLK 3P SIDE ENT 2.54MM PCB
Q1300 Q1301 = BSS138LT1G: as Q1200 on sheet ZHSD-USB-UART; ComponentLink1Description: Datasheet; ComponentLink1URL: https://www.onsemi.com/pdf/datasheet/bss138lt1-d.pdf; MPN: BSS138LT1G; Package: SOT-23-3
R1300 R1301 = RC0402FR-0760R4L: RES 60.4 OHM 1% 1/16W 0402 (1005); Manufacturer: YAGEO; Value: 60.4 Ohms; Voltage: 50V; ComponentLink1Description: Datasheet; ComponentLink1URL: https://yageogroup.com/content/datasheet/asset/file/PYU-RC_GROUP_51_ROHS_L; MPN: RC0402FR-0760R4L; Tolerance: ±1%; Package: 0402
R1302 R1303 R1306 R1307 = RC0402JR-074K7L: as R1100 on sheet ZHSD-ETHERNET; ComponentLink1Description: Datasheet; ComponentLink1URL: https://yageogroup.com/content/datasheet/asset/file/PYU-RC_GROUP_51_ROHS_L; Tolerance: ±5%; Package: 0402
R1304 R1308 = DNP_RES: as R1102 on sheet ZHSD-ETHERNET; ComponentLink1Description: Datasheet; ComponentLink1URL: https://yageogroup.com/content/datasheet/asset/file/PYU-RT_1-TO-0-01_ROHS_L; MPN: ***; Voltage: ***; Tolerance: ***; Package: 0402
R1305 = RC0402FR-07120RL: RES 120 OHM 1% 1/16W 0402 (1005); Manufacturer: YAGEO; Value: 120 Ohms; Voltage: 50V; ComponentLink1Description: Datasheet; ComponentLink1URL: https://yageogroup.com/content/datasheet/asset/file/PYU-RC_GROUP_51_ROHS_L; MPN: RC0402FR-07120RL; Tolerance: ±1%; Package: 0402
U1300 = TJA1040T/CM,118: CAN Interface IC High-Speed CAN Transceiver with Standby Mode SOIC8; Manufacturer: NXP USA Inc.; ComponentLink1Description: Datasheet; ComponentLink1URL: https://www.nxp.com/docs/en/data-sheet/TJA1040.pdf; MPN: TJA1040T/CM,118
U1301 = TXS0104EYZTR: Voltage Level Translator Bidirectional 1 Circuit 4 Channel 24Mbps 12-DSBGA (1.9x1.4); Manufacturer: Texas Instruments; ComponentLink1Description: Datasheet; ComponentLink1URL: https://www.ti.com/lit/ds/symlink/txs0104e.pdf?HQS=dis-dk-null-digikeymode-dsf-pf-null-wwe&ts=1769494565851&ref_url=https%253A%252F%252Fwww.ti.com%252Fgeneral%252Fdocs%252Fsuppproductinfo.tsp%253FdistId%253D10%2526gotoUrl%253Dhttps%253A%252F%252Fwww.ti.com%252Flit%252Fgpn%252Ftxs0104e; MPN: TXS0104EYZTR
U1302 = MAX3485ESA+T: 1/1 Transceiver Half RS422, RS485 8-SOIC; Manufacturer: Analog Devices Inc./Maxim Integrated; ComponentLink1Description: Datasheet; ComponentLink1URL: https://www.analog.com/media/en/technical-documentation/data-sheets/max3483-max3491.pdf; MPN: MAX3485ESA+T

## Sheet ZHSD-ZYNQ-PL.SchDoc
size A3; DrawnBy: UGUR KELES; DocumentNumber: 14; SheetNumber: 14; SheetTotal: 17; Size: A3
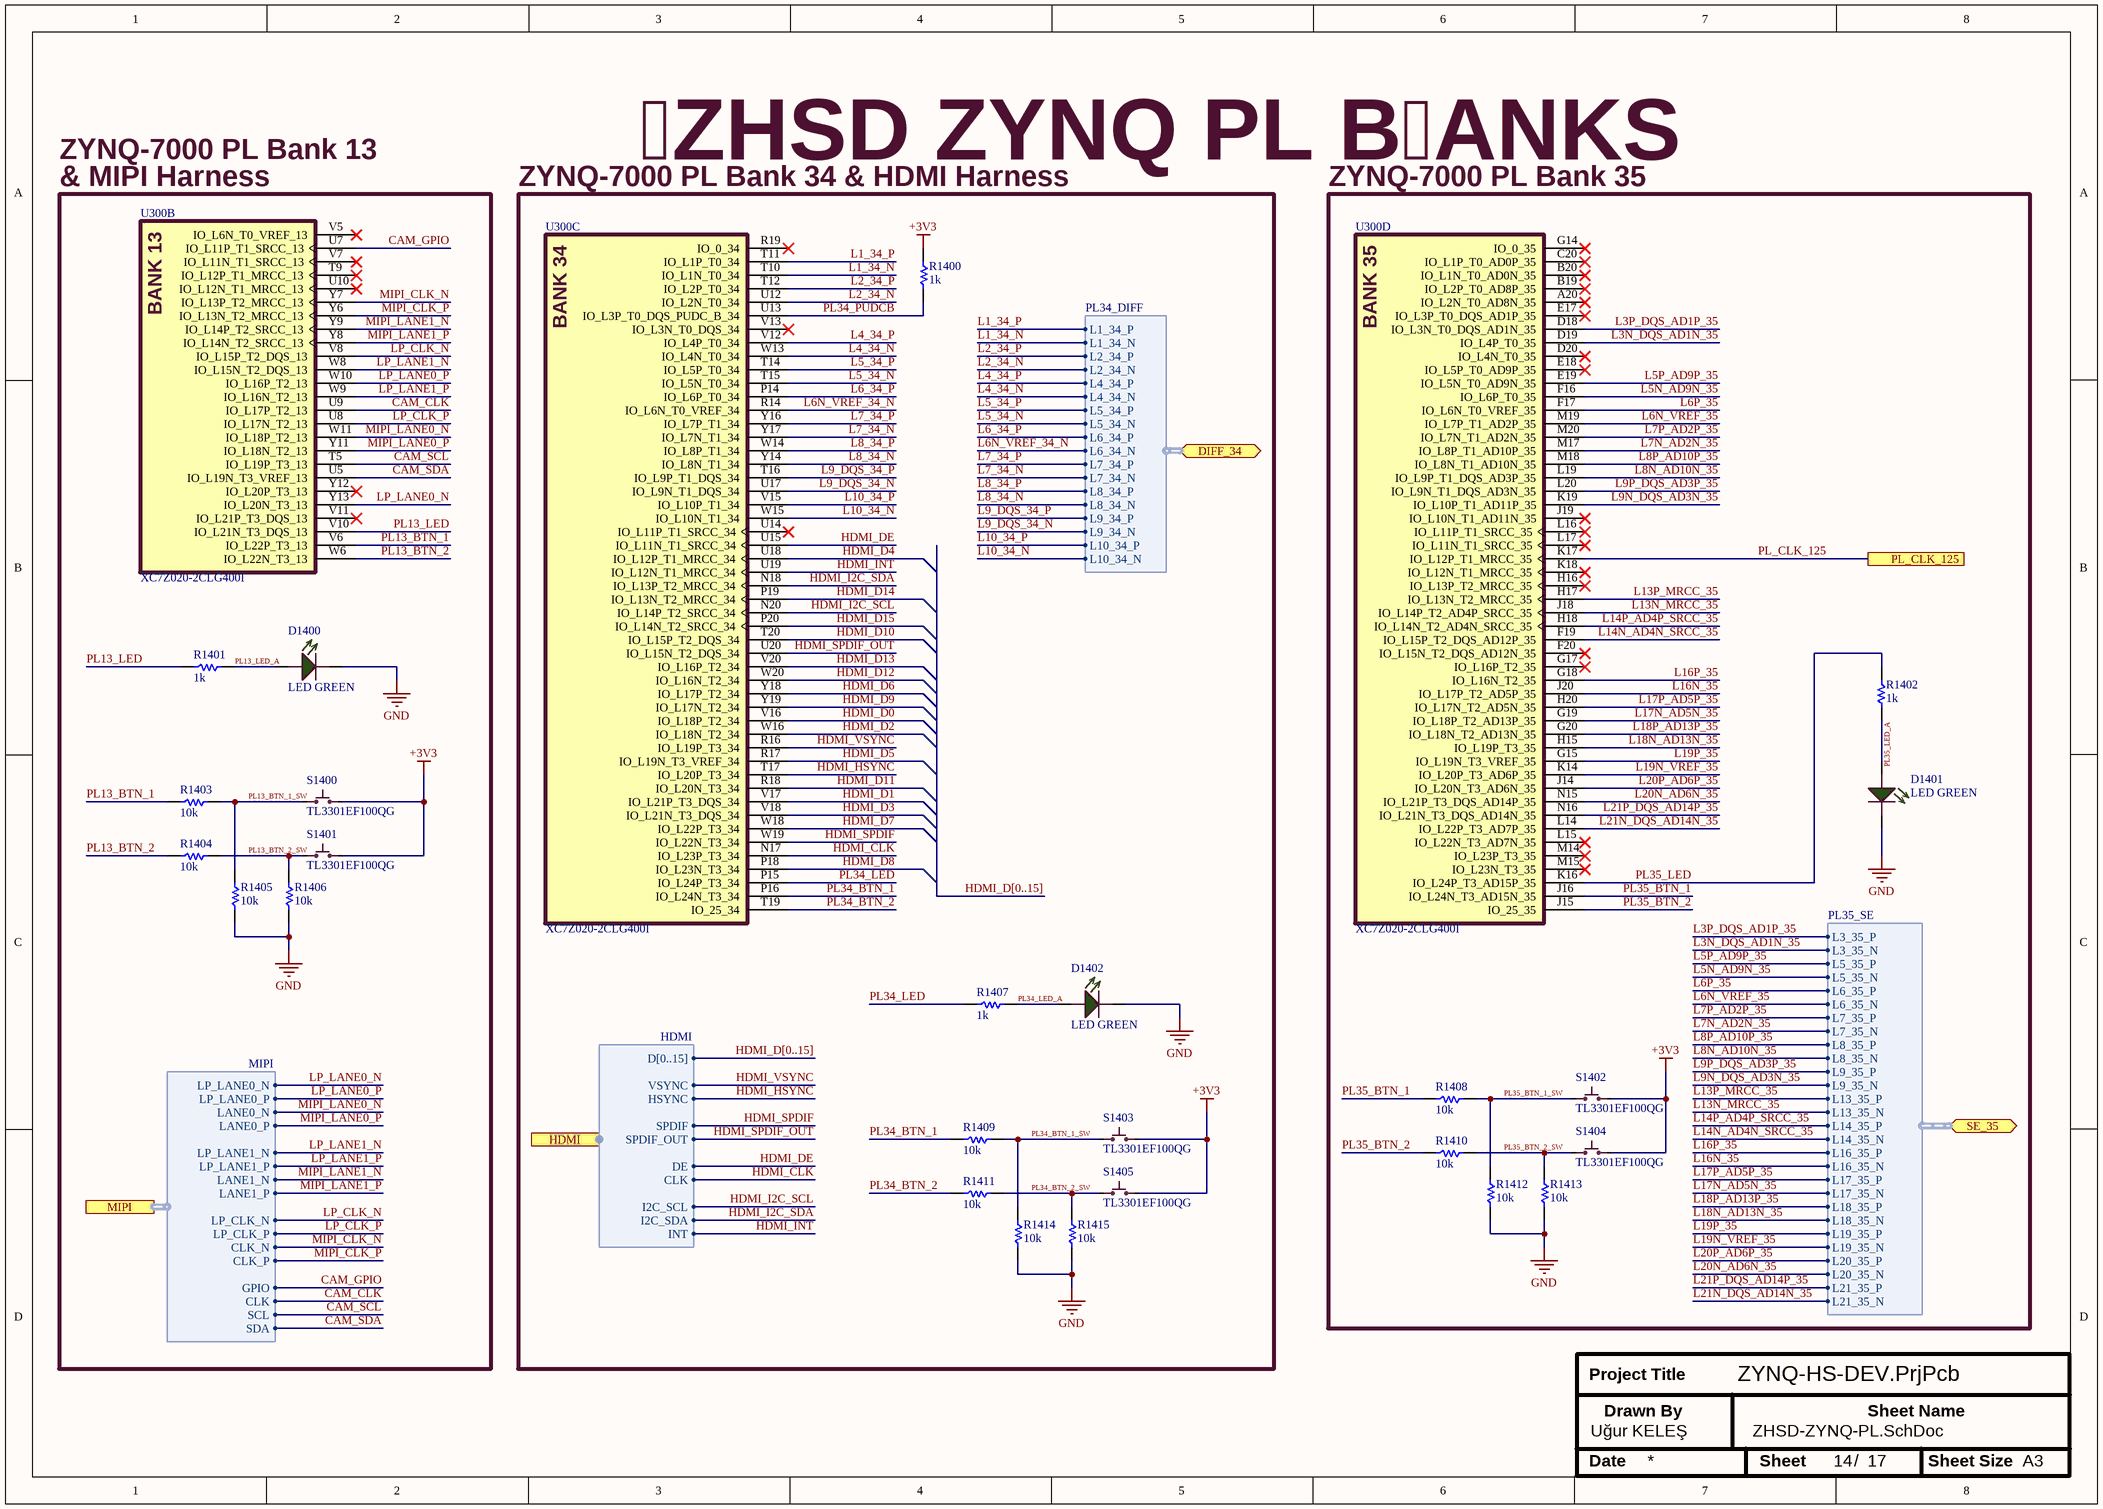
[diagram p10: ZHSD-ZYNQ-PL.SchDoc]

### Parts
D1400  LED GREEN  [0603_LED_1608N]
D1401  LED GREEN  [0603_LED_1608N]
D1402  LED GREEN  [0603_LED_1608N]
R1400  1k  [0402RESC1005X04N]
R1401  1k  [0402RESC1005X04N]
R1402  1k  [0402RESC1005X04N]
R1403  10k  [0603RESC1608X05N]
R1404  10k  [0603RESC1608X05N]
R1405  10k  [0603RESC1608X05N]
R1406  10k  [0603RESC1608X05N]
R1407  1k  [0402RESC1005X04N]
R1408  10k  [0603RESC1608X05N]
R1409  10k  [0603RESC1608X05N]
R1410  10k  [0603RESC1608X05N]
R1411  10k  [0603RESC1608X05N]
R1412  10k  [0603RESC1608X05N]
R1413  10k  [0603RESC1608X05N]
R1414  10k  [0603RESC1608X05N]
R1415  10k  [0603RESC1608X05N]
S1400  TL3301EF100QG  [TL3301_Tact_SW]
S1401  TL3301EF100QG  [TL3301_Tact_SW]
S1402  TL3301EF100QG  [TL3301_Tact_SW]
S1403  TL3301EF100QG  [TL3301_Tact_SW]
S1404  TL3301EF100QG  [TL3301_Tact_SW]
S1405  TL3301EF100QG  [TL3301_Tact_SW]
U300  XC7Z020-2CLG400I  [BGA400C80P20X20_1700X1700X147]  (parts B,C,D of 8)

### Blocks framed on the sheet
& MIPI Harness: D1400 R1401 R1403-R1406 S1400 S1401 U300
ZHSD ZYNQ PL BANKS: D1402 R1400 R1407 R1409 R1411 R1414 R1415 S1403 S1405 U300
ZYNQ-7000 PL Bank 35: D1401 R1402 R1408 R1410 R1412 R1413 S1402 S1404 U300

### Ports
DIFF_34 (bidir, harness PL34_DIFF, see ZHSD-Block[7500,1700], ZHSD-PL-CONNS[500,4200]), HDMI (harness HDMI, see ZHSD-Block[4400,1700], ZHSD-HDMI[600,3600]), MIPI (harness MIPI, see ZHSD-Block[4400,1100], ZHSD-MIPI-CSI2[1300,3900]), PL_CLK_125 (see ZHSD-Block[4400,1900], ZHSD-ETHERNET[3900,3000]), SE_35 (bidir, harness PL35_SE, see ZHSD-Block[7500,1400], ZHSD-PL-CONNS[10500,3800])

### Harnesses
HDMI: SPDIF, SPDIF_OUT, VSYNC, HSYNC, DE, CLK, INT, I2C_SCL, I2C_SDA, D[0..15]
MIPI: LANE0_N, LANE0_P, LANE1_N, LANE1_P, CLK_N, CLK_P, GPIO, CLK, SCL, SDA, LP_LANE0_N, LP_LANE0_P, LP_LANE1_N, LP_LANE1_P, LP_CLK_N, LP_CLK_P
PL34_DIFF: L1_34_P, L1_34_N, L2_34_P, L2_34_N, L4_34_P, L4_34_N, L5_34_P, L5_34_N, L6_34_P, L6_34_N, L7_34_P, L7_34_N, L8_34_P, L8_34_N, L9_34_P, L9_34_N, L10_34_P, L10_34_N
PL35_SE: L3_35_P, L3_35_N, L5_35_P, L5_35_N, L6_35_P, L6_35_N, L7_35_P, L7_35_N, L8_35_P, L8_35_N, L9_35_P, L9_35_N, L13_35_P, L13_35_N, L14_35_P, L14_35_N, L16_35_P, L16_35_N, L17_35_P, L17_35_N, L18_35_P, L18_35_N, L19_35_P, L19_35_N, L20_35_P, L20_35_N, L21_35_P, L21_35_N

### Nets
+3V3: R1400.1 S1400.3,4 S1401.3,4 S1402.3,4 S1403.3,4 S1404.3,4 S1405.3,4
GND: D1400.2(C) D1401.2(C) D1402.2(C) R1405.2 R1406.2 R1412.2 R1413.2 R1414.2 R1415.2
CAM_CLK: U300.U9(IO_L17P_T2_13) ; port MIPI.CLK
CAM_GPIO: U300.U7(IO_L11P_T1_SRCC_13) ; port MIPI.GPIO
CAM_SCL: U300.T5(IO_L19P_T3_13) ; port MIPI.SCL
CAM_SDA: U300.U5(IO_L19N_T3_VREF_13) ; port MIPI.SDA
HDMI_CLK: U300.N17(IO_L23P_T3_34) ; port HDMI.CLK
HDMI_D0: U300.V16(IO_L18P_T2_34)
HDMI_D1: U300.V17(IO_L21P_T3_DQS_34)
HDMI_D2: U300.W16(IO_L18N_T2_34)
HDMI_D3: U300.V18(IO_L21N_T3_DQS_34)
HDMI_D4: U300.U18(IO_L12P_T1_MRCC_34)
HDMI_D5: U300.R17(IO_L19N_T3_VREF_34)
HDMI_D6: U300.Y18(IO_L17P_T2_34)
HDMI_D7: U300.W18(IO_L22P_T3_34)
HDMI_D8: U300.P18(IO_L23N_T3_34)
HDMI_D9: U300.Y19(IO_L17N_T2_34)
HDMI_D10: U300.T20(IO_L15P_T2_DQS_34)
HDMI_D11: U300.R18(IO_L20N_T3_34)
HDMI_D12: U300.W20(IO_L16N_T2_34)
HDMI_D13: U300.V20(IO_L16P_T2_34)
HDMI_D14: U300.P19(IO_L13N_T2_MRCC_34)
HDMI_D15: U300.P20(IO_L14N_T2_SRCC_34)
HDMI_DE: U300.U15(IO_L11N_T1_SRCC_34) ; port HDMI.DE
HDMI_HSYNC: U300.T17(IO_L20P_T3_34) ; port HDMI.HSYNC
HDMI_I2C_SCL: U300.N20(IO_L14P_T2_SRCC_34) ; port HDMI.I2C_SCL
HDMI_I2C_SDA: U300.N18(IO_L13P_T2_MRCC_34) ; port HDMI.I2C_SDA
HDMI_INT: U300.U19(IO_L12N_T1_MRCC_34) ; port HDMI.INT
HDMI_SPDIF: U300.W19(IO_L22N_T3_34) ; port HDMI.SPDIF
HDMI_SPDIF_OUT: U300.U20(IO_L15N_T2_DQS_34) ; port HDMI.SPDIF_OUT
HDMI_VSYNC: U300.R16(IO_L19P_T3_34) ; port HDMI.VSYNC
L1_34_N: U300.T10(IO_L1N_T0_34) ; port DIFF_34.L1_34_N  [project net DIFF34.L1_34_N]
L1_34_P: U300.T11(IO_L1P_T0_34) ; port DIFF_34.L1_34_P  [project net DIFF34.L1_34_P]
L2_34_N: U300.U12(IO_L2N_T0_34) ; port DIFF_34.L2_34_N  [project net DIFF34.L2_34_N]
L2_34_P: U300.T12(IO_L2P_T0_34) ; port DIFF_34.L2_34_P  [project net DIFF34.L2_34_P]
L3N_DQS_AD1N_35: U300.D19(IO_L4P_T0_35) ; port SE_35.L3_35_N  [project net SE35.L3_35_N]
L3P_DQS_AD1P_35: U300.D18(IO_L3N_T0_DQS_AD1N_35) ; port SE_35.L3_35_P  [project net SE35.L3_35_P]
L4_34_N: U300.W13(IO_L4N_T0_34) ; port DIFF_34.L4_34_N  [project net DIFF34.L4_34_N]
L4_34_P: U300.V12(IO_L4P_T0_34) ; port DIFF_34.L4_34_P  [project net DIFF34.L4_34_P]
L5_34_N: U300.T15(IO_L5N_T0_34) ; port DIFF_34.L5_34_N  [project net DIFF34.L5_34_N]
L5_34_P: U300.T14(IO_L5P_T0_34) ; port DIFF_34.L5_34_P  [project net DIFF34.L5_34_P]
L5N_AD9N_35: U300.F16(IO_L6P_T0_35) ; port SE_35.L5_35_N  [project net SE35.L5_35_N]
L5P_AD9P_35: U300.E19(IO_L5N_T0_AD9N_35) ; port SE_35.L5_35_P  [project net SE35.L5_35_P]
L6_34_P: U300.P14(IO_L6P_T0_34) ; port DIFF_34.L6_34_P  [project net DIFF34.L6_34_P]
L6N_VREF_34_N: U300.R14(IO_L6N_T0_VREF_34) ; port DIFF_34.L6_34_N  [project net DIFF34.L6_34_N]
L6N_VREF_35: U300.M19(IO_L7P_T1_AD2P_35) ; port SE_35.L6_35_N  [project net SE35.L6_35_N]
L6P_35: U300.F17(IO_L6N_T0_VREF_35) ; port SE_35.L6_35_P  [project net SE35.L6_35_P]
L7_34_N: U300.Y17(IO_L7N_T1_34) ; port DIFF_34.L7_34_N  [project net DIFF34.L7_34_N]
L7_34_P: U300.Y16(IO_L7P_T1_34) ; port DIFF_34.L7_34_P  [project net DIFF34.L7_34_P]
L7N_AD2N_35: U300.M17(IO_L8P_T1_AD10P_35) ; port SE_35.L7_35_N  [project net SE35.L7_35_N]
L7P_AD2P_35: U300.M20(IO_L7N_T1_AD2N_35) ; port SE_35.L7_35_P  [project net SE35.L7_35_P]
L8_34_N: U300.Y14(IO_L8N_T1_34) ; port DIFF_34.L8_34_N  [project net DIFF34.L8_34_N]
L8_34_P: U300.W14(IO_L8P_T1_34) ; port DIFF_34.L8_34_P  [project net DIFF34.L8_34_P]
L8N_AD10N_35: U300.L19(IO_L9P_T1_DQS_AD3P_35) ; port SE_35.L8_35_N  [project net SE35.L8_35_N]
L8P_AD10P_35: U300.M18(IO_L8N_T1_AD10N_35) ; port SE_35.L8_35_P  [project net SE35.L8_35_P]
L9_DQS_34_N: U300.U17(IO_L9N_T1_DQS_34) ; port DIFF_34.L9_34_N  [project net DIFF34.L9_34_N]
L9_DQS_34_P: U300.T16(IO_L9P_T1_DQS_34) ; port DIFF_34.L9_34_P  [project net DIFF34.L9_34_P]
L9N_DQS_AD3N_35: U300.K19(IO_L10P_T1_AD11P_35) ; port SE_35.L9_35_N  [project net SE35.L9_35_N]
L9P_DQS_AD3P_35: U300.L20(IO_L9N_T1_DQS_AD3N_35) ; port SE_35.L9_35_P  [project net SE35.L9_35_P]
L10_34_N: U300.W15(IO_L10N_T1_34) ; port DIFF_34.L10_34_N  [project net DIFF34.L10_34_N]
L10_34_P: U300.V15(IO_L10P_T1_34) ; port DIFF_34.L10_34_P  [project net DIFF34.L10_34_P]
L13N_MRCC_35: U300.J18(IO_L14P_T2_AD4P_SRCC_35) ; port SE_35.L13_35_N  [project net SE35.L13_35_N]
L13P_MRCC_35: U300.H17(IO_L13N_T2_MRCC_35) ; port SE_35.L13_35_P  [project net SE35.L13_35_P]
L14N_AD4N_SRCC_35: U300.F19(IO_L15P_T2_DQS_AD12P_35) ; port SE_35.L14_35_N  [project net SE35.L14_35_N]
L14P_AD4P_SRCC_35: U300.H18(IO_L14N_T2_AD4N_SRCC_35) ; port SE_35.L14_35_P  [project net SE35.L14_35_P]
L16N_35: U300.J20(IO_L17P_T2_AD5P_35) ; port SE_35.L16_35_N  [project net SE35.L16_35_N]
L16P_35: U300.G18(IO_L16N_T2_35) ; port SE_35.L16_35_P  [project net SE35.L16_35_P]
L17N_AD5N_35: U300.G19(IO_L18P_T2_AD13P_35) ; port SE_35.L17_35_N  [project net SE35.L17_35_N]
L17P_AD5P_35: U300.H20(IO_L17N_T2_AD5N_35) ; port SE_35.L17_35_P  [project net SE35.L17_35_P]
L18N_AD13N_35: U300.H15(IO_L19P_T3_35) ; port SE_35.L18_35_N  [project net SE35.L18_35_N]
L18P_AD13P_35: U300.G20(IO_L18N_T2_AD13N_35) ; port SE_35.L18_35_P  [project net SE35.L18_35_P]
L19N_VREF_35: U300.K14(IO_L20P_T3_AD6P_35) ; port SE_35.L19_35_N  [project net SE35.L19_35_N]
L19P_35: U300.G15(IO_L19N_T3_VREF_35) ; port SE_35.L19_35_P  [project net SE35.L19_35_P]
L20N_AD6N_35: U300.N15(IO_L21P_T3_DQS_AD14P_35) ; port SE_35.L20_35_N  [project net SE35.L20_35_N]
L20P_AD6P_35: U300.J14(IO_L20N_T3_AD6N_35) ; port SE_35.L20_35_P  [project net SE35.L20_35_P]
L21N_DQS_AD14N_35: U300.L14(IO_L22P_T3_AD7P_35) ; port SE_35.L21_35_N  [project net SE35.L21_35_N]
L21P_DQS_AD14P_35: U300.N16(IO_L21N_T3_DQS_AD14N_35) ; port SE_35.L21_35_P  [project net SE35.L21_35_P]
LP_CLK_N: U300.V8(IO_L15P_T2_DQS_13) ; port MIPI.LP_CLK_N
LP_CLK_P: U300.U8(IO_L17N_T2_13) ; port MIPI.LP_CLK_P
LP_LANE0_N: U300.Y13(IO_L20N_T3_13) ; port MIPI.LP_LANE0_N
LP_LANE0_P: U300.W10(IO_L16P_T2_13) ; port MIPI.LP_LANE0_P
LP_LANE1_N: U300.W8(IO_L15N_T2_DQS_13) ; port MIPI.LP_LANE1_N
LP_LANE1_P: U300.W9(IO_L16N_T2_13) ; port MIPI.LP_LANE1_P
MIPI_CLK_N: U300.Y7(IO_L13P_T2_MRCC_13) ; port MIPI.CLK_N
MIPI_CLK_P: U300.Y6(IO_L13N_T2_MRCC_13) ; port MIPI.CLK_P
MIPI_LANE0_N: U300.W11(IO_L18P_T2_13) ; port MIPI.LANE0_N
MIPI_LANE0_P: U300.Y11(IO_L18N_T2_13) ; port MIPI.LANE0_P
MIPI_LANE1_N: U300.Y9(IO_L14P_T2_SRCC_13) ; port MIPI.LANE1_N
MIPI_LANE1_P: U300.Y8(IO_L14N_T2_SRCC_13) ; port MIPI.LANE1_P
PL13_BTN_1: R1403.2 U300.V6(IO_L22P_T3_13)
PL13_BTN_1_SW: R1403.1 R1405.1 S1400.1,2
PL13_BTN_2: R1404.2 U300.W6(IO_L22N_T3_13)
PL13_BTN_2_SW: R1404.1 R1406.1 S1401.1,2
PL13_LED: R1401.2 U300.V10(IO_L21N_T3_DQS_13)
PL13_LED_A: D1400.1(A) R1401.1
PL34_BTN_1: R1409.2 U300.P16(IO_L24N_T3_34)
PL34_BTN_1_SW: R1409.1 R1414.1 S1403.1,2
PL34_BTN_2: R1411.2 U300.T19(IO_25_34)
PL34_BTN_2_SW: R1411.1 R1415.1 S1405.1,2
PL34_LED: R1407.2 U300.P15(IO_L24P_T3_34)
PL34_LED_A: D1402.1(A) R1407.1
PL34_PUDCB: R1400.2 U300.U13(IO_L3P_T0_DQS_PUDC_B_34)
PL35_BTN_1: R1408.2 U300.J16(IO_L24N_T3_AD15N_35)
PL35_BTN_1_SW: R1408.1 R1412.1 S1402.1,2
PL35_BTN_2: R1410.2 U300.J15(IO_25_35)
PL35_BTN_2_SW: R1410.1 R1413.1 S1404.1,2
PL35_LED: R1402.2 U300.K16(IO_L24P_T3_AD15P_35)
PL35_LED_A: D1401.1(A) R1402.1
PL_CLK_125: U300.K17(IO_L12P_T1_MRCC_35) ; port PL_CLK_125

Not connected (* = marked no-connect by the designer): U300 A20(IO_L2N_T0_AD8N_35)* B19(IO_L2P_T0_AD8P_35)* B20(IO_L1N_T0_AD0N_35)* C20(IO_L1P_T0_AD0P_35)* D20(IO_L4N_T0_35)* E17(IO_L3P_T0_DQS_AD1P_35)* E18(IO_L5P_T0_AD9P_35)* F20(IO_L15N_T2_DQS_AD12N_35)* G14(IO_0_35)* G17(IO_L16P_T2_35)* H16(IO_L13P_T2_MRCC_35)* J19(IO_L10N_T1_AD11N_35)* K18(IO_L12N_T1_MRCC_35)* L15(IO_L22N_T3_AD7N_35)* L16(IO_L11P_T1_SRCC_35)* L17(IO_L11N_T1_SRCC_35)* M14(IO_L23P_T3_35)* M15(IO_L23N_T3_35)* R19(IO_0_34)* T9(IO_L12P_T1_MRCC_13)* U10(IO_L12N_T1_MRCC_13)* U14(IO_L11P_T1_SRCC_34)* V5(IO_L6N_T0_VREF_13)* V7(IO_L11N_T1_SRCC_13)* V11(IO_L21P_T3_DQS_13)* V13(IO_L3N_T0_DQS_34)* Y12(IO_L20P_T3_13)*

### Buses and harness runs
bus HDMI_D[0..15]

### Notes on the sheet
- ZYNQ-7000 PL Bank 13
- ZYNQ-7000 PL Bank 34 & HDMI Harness
- Project Title
- Uğur KELEŞ
- Drawn By
- Sheet Name
- Date
- Sheet
- /
- Sheet Size
- A3
- (in symbol XC7Z020-2CLG400I, part B) BANK 13
- (in symbol XC7Z020-2CLG400I, part C) BANK 34
- (in symbol XC7Z020-2CLG400I, part D) BANK 35

### Library data of the parts
D1400-D1402 = LTST-C191TGKT: LED GREEN CLEAR CHIP SMD; Manufacturer: Lite-On Inc.; ComponentLink1Description: Datasheet; ComponentLink1URL: https://optoelectronics.liteon.com/upload/download/DS22-2000-300/LTST-C191TGKT.PDF; MPN: LTST-C191TGKT; Package: 0603
R1400-R1402 R1407 = RC0402JR-071KL: RES 1K OHM 5% 1/16W 0402 (1005); Manufacturer: YAGEO; Value: 1 kOhms; Voltage: 50V; ComponentLink1Description: Datasheet; ComponentLink1URL: https://yageogroup.com/content/datasheet/asset/file/PYU-RT_1-TO-0-01_ROHS_L; MPN: RC0402JR-071KL; Tolerance: ±5%; Package: 0402
R1403-R1406 R1408-R1415 = RC0603FR-0710KL: RES 10K OHM 1% 1/10W 0603(1608); Manufacturer: YAGEO; Value: 10 kOhms; Voltage: 75V; ComponentLink1Description: Datasheet; ComponentLink1URL: https://yageogroup.com/content/datasheet/asset/file/PYU-RC_GROUP_51_ROHS_L; MPN: RC0603FR-0710KL; Tolerance: ±1%; Package: 0603
S1400-S1405 = TL3301EF100QG: SWITCH TACTILE SPST-NO 0.05A 12V; pin to pad: 1,2>1+2 3,4>3+4; Manufacturer: E-Switch; ComponentLink1Description: Datasheet; ComponentLink1URL: https://configured-product-images.s3.amazonaws.com/Datasheets/TL3301.pdf; MPN: TL3301EF100QG
U300 = XC7Z020-2CLG400I: Dual ARM® Cortex®-A9 MPCore™ with CoreSight™ System On Chip (SOC) IC Zynq®-7000 Artix™-7 FPGA, 85K Logic Cells 766MHz 400-CSPBGA (17x17); Manufacturer: AMD/XILINX; MPN: XC7Z020-2CLG400I; ComponentLink1Description: Datasheet; ComponentLink1URL: https://docs.amd.com/v/u/en-US/ds190-Zynq-7000-Overview; ComponentLink2Description: DC and AC Switching Characteristics; ComponentLink2URL: https://docs.amd.com/v/u/en-US/ds187-XC7Z010-XC7Z020-Data-Sheet; ComponentLink3Description: PCB Design Guide; ComponentLink3URL: https://docs.amd.com/v/u/en-US/ug933-Zynq-7000-PCB; ComponentLink4Description: Packaging and Pinout; ComponentLink4URL: https://docs.amd.com/v/u/en-US/ug865-Zynq-7000-Pkg-Pinout; ComponentLink5Description: Zynq 7000 SoC Technical Reference Manual; ComponentLink5URL: https://docs.amd.com/r/en-US/ug585-zynq-7000-SoC-TRM